# Altium project QUTMS_HVBoard_V1_1.PrjPcb
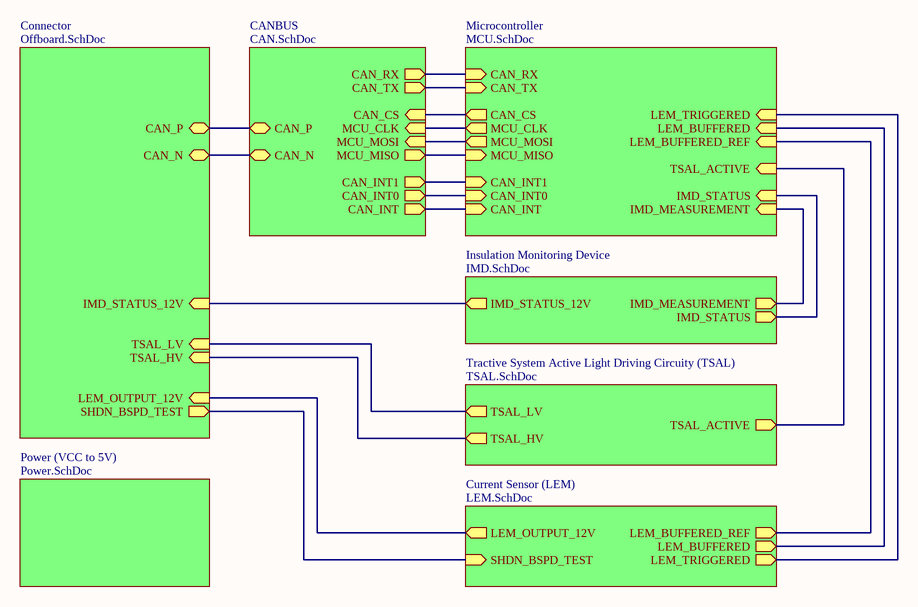
[diagram p0: Master.SchDoc]
8 sheets, 128 parts. Net scope: hierarchical (ports join the sheet entries above them; power ports are global).
Board file: HVBoard.PcbDoc
Sheets:
  Master.SchDoc
    Connector = Offboard.SchDoc
    Microcontroller = MCU.SchDoc
    Insulation Monitoring Device = IMD.SchDoc
    Current Sensor (LEM) = LEM.SchDoc
    CANBUS = CAN.SchDoc
    Tractive System Active Light Driving Circuity (TSAL) = TSAL.SchDoc
    Power (VCC to 5V) = Power.SchDoc

## Sheet Master.SchDoc: QUTMS HVBoard V1.1 - Master
size A4; DocumentNumber: 1; SheetNumber: 1; SheetTotal: 8

### Sub-sheets
CANBUS = CAN.SchDoc: MCU_MOSI (in), MCU_CLK (in), CAN_CS (in), MCU_MISO (out), CAN_N (bidir), CAN_P (bidir), CAN_INT1 (out), CAN_INT0 (out), CAN_INT (out), CAN_RX (out), CAN_TX (out)
Connector = Offboard.SchDoc: SHDN_BSPD_TEST (out), TSAL_LV (in), CAN_P (bidir), TSAL_HV (in), CAN_N (bidir), LEM_OUTPUT_12V (in), IMD_STATUS_12V (in)
Current Sensor (LEM) = LEM.SchDoc: SHDN_BSPD_TEST (in), LEM_BUFFERED_REF (out), LEM_BUFFERED (out), LEM_OUTPUT_12V (out), LEM_TRIGGERED (out)
Insulation Monitoring Device = IMD.SchDoc: IMD_STATUS_12V (out), IMD_MEASUREMENT (out), IMD_STATUS (out)
Microcontroller = MCU.SchDoc: CAN_INT (in), CAN_INT0 (in), CAN_INT1 (in), MCU_MISO (in), MCU_MOSI (out), MCU_CLK (out), CAN_CS (out), LEM_BUFFERED_REF (in), LEM_BUFFERED (in), IMD_MEASUREMENT (in), IMD_STATUS (in), TSAL_ACTIVE (in), LEM_TRIGGERED (in), CAN_RX (in), CAN_TX (in)
Power (VCC to 5V) = Power.SchDoc: no entries
Tractive System Active Light Driving Circuity (TSAL) = TSAL.SchDoc: TSAL_HV (out), TSAL_LV (out), TSAL_ACTIVE (out)

### Nets
CAN_CS: sheet Microcontroller/CAN_CS, sheet CANBUS/CAN_CS
CAN_INT: sheet Microcontroller/CAN_INT, sheet CANBUS/CAN_INT
CAN_INT0: sheet Microcontroller/CAN_INT0, sheet CANBUS/CAN_INT0
CAN_INT1: sheet Microcontroller/CAN_INT1, sheet CANBUS/CAN_INT1
CAN_N: sheet Connector/CAN_N, sheet CANBUS/CAN_N
CAN_P: sheet Connector/CAN_P, sheet CANBUS/CAN_P
CAN_RX: sheet Microcontroller/CAN_RX, sheet CANBUS/CAN_RX
CAN_TX: sheet Microcontroller/CAN_TX, sheet CANBUS/CAN_TX
IMD_MEASUREMENT: sheet Microcontroller/IMD_MEASUREMENT, sheet Insulation Monitoring Device/IMD_MEASUREMENT
IMD_STATUS: sheet Microcontroller/IMD_STATUS, sheet Insulation Monitoring Device/IMD_STATUS
LEM_BUFFERED: sheet Microcontroller/LEM_BUFFERED, sheet Current Sensor (LEM)/LEM_BUFFERED
LEM_BUFFERED_REF: sheet Microcontroller/LEM_BUFFERED_REF, sheet Current Sensor (LEM)/LEM_BUFFERED_REF
MCU_CLK: sheet Microcontroller/MCU_CLK, sheet CANBUS/MCU_CLK
MCU_MISO: sheet Microcontroller/MCU_MISO, sheet CANBUS/MCU_MISO
MCU_MOSI: sheet Microcontroller/MCU_MOSI, sheet CANBUS/MCU_MOSI
TSAL_ACTIVE: sheet Microcontroller/TSAL_ACTIVE, sheet Tractive System Active Light Driving Circuity (TSAL)/TSAL_ACTIVE
NetJ4_2: sheet Connector/SHDN_BSPD_TEST, sheet Current Sensor (LEM)/SHDN_BSPD_TEST
NetJ4_4: sheet Connector/IMD_STATUS_12V, sheet Insulation Monitoring Device/IMD_STATUS_12V
NetJ4_5: sheet Connector/TSAL_HV, sheet Tractive System Active Light Driving Circuity (TSAL)/TSAL_HV
NetJ4_8: sheet Connector/TSAL_LV, sheet Tractive System Active Light Driving Circuity (TSAL)/TSAL_LV
NetJ4_9: sheet Connector/LEM_OUTPUT_12V, sheet Current Sensor (LEM)/LEM_OUTPUT_12V
NetR10_2: sheet Microcontroller/LEM_TRIGGERED, sheet Current Sensor (LEM)/LEM_TRIGGERED

### Notes on the sheet
- Title
- Size:
- A4
- Number:
- Revision:
- QUT Motorsport, O-120
- O Block, QUT Gardens Point
- Date:
- Time:
- Sheet
- of
- Brisbane, QLD, Australia

## Sheet Offboard.SchDoc: QUTMS HVBoard V1.1 - Offboard
size A4; Author: Jonn Dillon; Organization: QUT Motorsport; Address1: O-120; Address2: O Block; Address3: QUT Gardens Point; Address4: Brisbane, 4000; DocumentNumber: 8; SheetNumber: 8; SheetTotal: 8
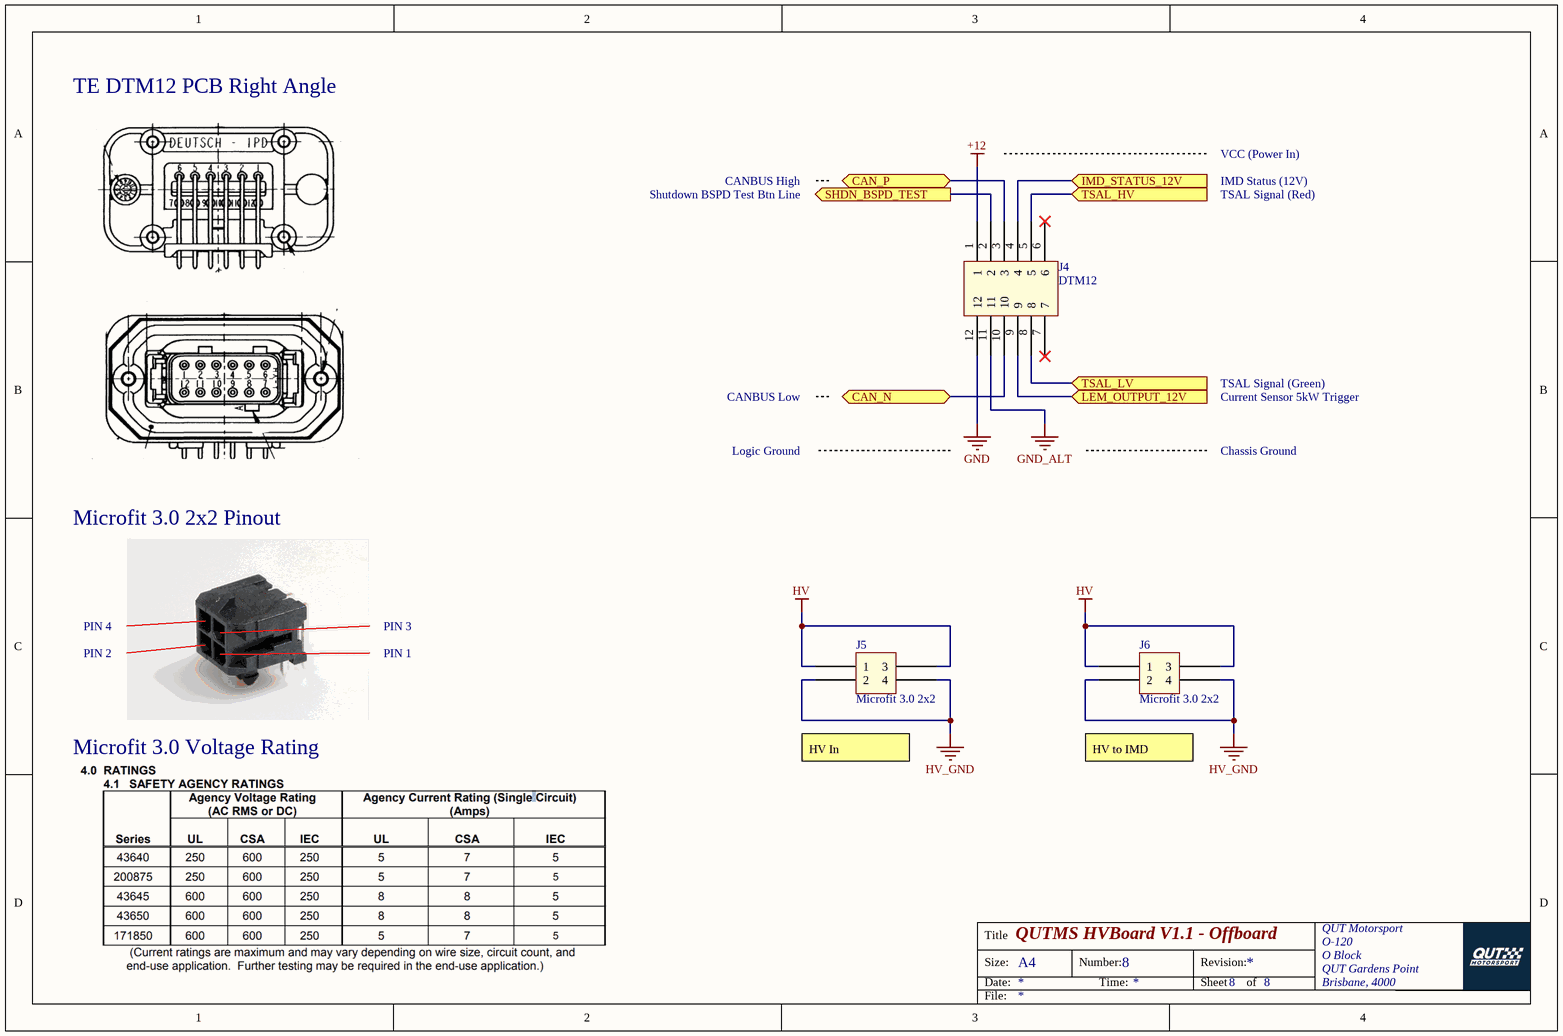
[diagram p1: Offboard.SchDoc]

### Parts
J4  DTM12  [DTM13-12PA]
J5  Microfit 3.0 2x2  [Microfit_2X2_R_TH]
J6  Microfit 3.0 2x2  [Microfit_2X2_R_TH]

### Ports
CAN_N (bidir), CAN_P (bidir), IMD_STATUS_12V (in), LEM_OUTPUT_12V (in), SHDN_BSPD_TEST (out), TSAL_HV (in), TSAL_LV (in)

### Nets
+12: J4.1
GND: J4.12
GND_ALT: J4.11
HV: J5.1 J5.3 J6.1 J6.3
HV_GND: J5.2 J5.4 J6.2 J6.4
CAN_N: J4.10 ; port CAN_N
CAN_P: J4.3 ; port CAN_P
NetJ4_2: J4.2 ; port SHDN_BSPD_TEST
NetJ4_4: J4.4 ; port IMD_STATUS_12V
NetJ4_5: J4.5 ; port TSAL_HV
NetJ4_8: J4.8 ; port TSAL_LV
NetJ4_9: J4.9 ; port LEM_OUTPUT_12V

Not connected (* = marked no-connect by the designer): J4 6* 7*

### Notes on the sheet
- TE DTM12 PCB Right Angle
- CANBUS High
- IMD Status (12V)
- VCC (Power In)
- Shutdown BSPD Test Btn Line
- TSAL Signal (Red)
- TSAL Signal (Green)
- CANBUS Low
- Logic Ground
- Chassis Ground
- Current Sensor 5kW Trigger
- Microfit 3.0 2x2 Pinout
- PIN 2
- PIN 4
- PIN 1
- PIN 3
- Microfit 3.0 Voltage Rating
- HV In
- HV to IMD
- Title
- Size:
- Date:
- A4
- Number:
- Time:
- Revision:
- Sheet
- of
- File:

### Library data of the parts
J5 J6 = Microfit_2x2

## Sheet MCU.SchDoc: QUTMS HVBoard V1.1 - MCU
size A4; Author: Jonn Dillon; Organization: QUT Motorsport; Address1: O-120; Address2: O Block; Address3: QUT Gardens Point; Address4: Brisbane, 4000; DocumentNumber: 5; SheetNumber: 5; SheetTotal: 8
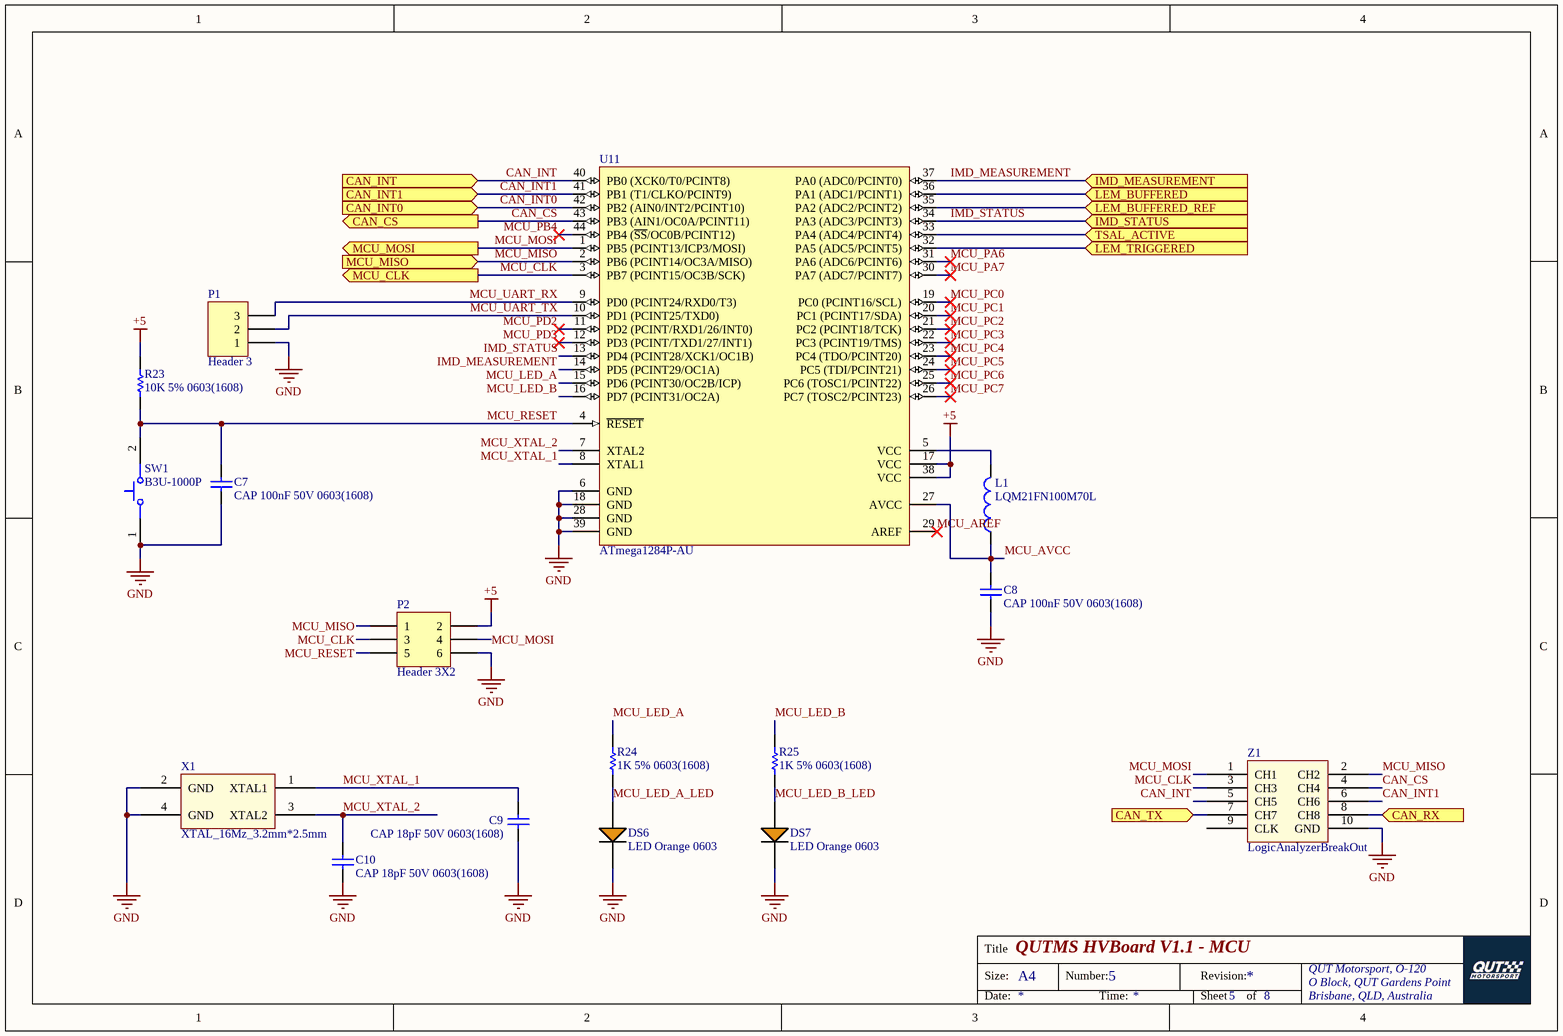
[diagram p2: MCU.SchDoc]

### Parts
C7  CAP 100nF 50V 0603(1608)  [CAPC0603(1608)100_L]
C8  CAP 100nF 50V 0603(1608)  [CAPC0603(1608)100_L]
C9  CAP 18pF 50V 0603(1608)  [CAPC0603(1608)100_L]
C10  CAP 18pF 50V 0603(1608)  [CAPC0603(1608)100_L]
DS6  LED Orange 0603  [LED ORANGE 0603]
DS7  LED Orange 0603  [LED ORANGE 0603]
L1  LQM21FN100M70L  [MURA-IND0805_L]
P1  Header 3  [HDR1X3]
P2  Header 3X2  [HDR2X3]
R23  10K 5% 0603(1608)  [RESC0603(1608)_N]
R24  1K 5% 0603(1608)  [RESC0603(1608)_L]
R25  1K 5% 0603(1608)  [RESC0603(1608)_L]
SW1  B3U-1000P  [OMRON-B3U-1000_V]
U11  ATmega1284P-AU  [44A_N]
X1  XTAL_16Mz_3.2mm*2.5mm  [3.2mm*2.5mm]
Z1  LogicAnalyzerBreakOut  [LogicAnalyzer]

### Ports
CAN_CS (out), CAN_INT0 (in), CAN_INT1 (in), CAN_INT (in), CAN_RX (in), CAN_TX (in), IMD_MEASUREMENT (in), IMD_STATUS (in), LEM_BUFFERED (in), LEM_BUFFERED_REF (in), LEM_TRIGGERED (in), MCU_CLK (out), MCU_MISO (in), MCU_MOSI (out), TSAL_ACTIVE (in)

### Nets
+5: P2.2 R23.2 U11.17(VCC) U11.38(VCC)
GND: C7.2 C8.2 C9.1 C10.1 DS6.2(C) DS7.2(C) P1.1 P2.6 SW1.1 U11.6(GND) U11.18(GND) U11.28(GND) U11.39(GND) X1.2(GND) X1.4(GND) Z1.10(GND)
CAN_CS: U11.43(PB3_(AIN1/OC0A/PCINT11)) Z1.4(CH4) ; port CAN_CS
CAN_INT: U11.40(PB0_(XCK0/T0/PCINT8)) Z1.5(CH5) ; port CAN_INT
CAN_INT0: U11.42(PB2_(AIN0/INT2/PCINT10)) ; port CAN_INT0
CAN_INT1: U11.41(PB1_(T1/CLKO/PCINT9)) Z1.6(CH6) ; port CAN_INT1
CAN_RX: Z1.8(CH8) ; port CAN_RX
CAN_TX: Z1.7(CH7) ; port CAN_TX
IMD_MEASUREMENT: U11.14(PD5_(PCINT29/OC1A)) U11.37(PA0_(ADC0/PCINT0)) ; port IMD_MEASUREMENT
IMD_STATUS: U11.13(PD4_(PCINT28/XCK1/OC1B)) U11.34(PA3_(ADC3/PCINT3)) ; port IMD_STATUS
LEM_BUFFERED: U11.36(PA1_(ADC1/PCINT1)) ; port LEM_BUFFERED
LEM_BUFFERED_REF: U11.35(PA2_(ADC2/PCINT2)) ; port LEM_BUFFERED_REF
MCU_AREF: U11.29(AREF)
MCU_AVCC: C8.1 L1.1 U11.27(AVCC)
MCU_CLK: P2.3 U11.3(PB7_(PCINT15/OC3B/SCK)) Z1.3(CH3) ; port MCU_CLK
MCU_LED_A: R24.2 U11.15(PD6_(PCINT30/OC2B/ICP))
MCU_LED_A_LED: DS6.1(A) R24.1
MCU_LED_B: R25.2 U11.16(PD7_(PCINT31/OC2A))
MCU_LED_B_LED: DS7.1(A) R25.1
MCU_MISO: P2.1 U11.2(PB6_(PCINT14/OC3A/MISO)) Z1.2(CH2) ; port MCU_MISO
MCU_MOSI: P2.4 U11.1(PB5_(PCINT13/ICP3/MOSI)) Z1.1(CH1) ; port MCU_MOSI
MCU_PA6: U11.31(PA6_(ADC6/PCINT6))
MCU_PA7: U11.30(PA7_(ADC7/PCINT7))
MCU_PB4: U11.44(PB4_(~{SS}/OC0B/PCINT12))
MCU_PC0: U11.19(PC0_(PCINT16/SCL))
MCU_PC1: U11.20(PC1_(PCINT17/SDA))
MCU_PC2: U11.21(PC2_(PCINT18/TCK))
MCU_PC3: U11.22(PC3_(PCINT19/TMS))
MCU_PC4: U11.23(PC4_(TDO/PCINT20))
MCU_PC5: U11.24(PC5_(TDI/PCINT21))
MCU_PC6: U11.25(PC6_(TOSC1/PCINT22))
MCU_PC7: U11.26(PC7_(TOSC2/PCINT23))
MCU_PD2: U11.11(PD2_(PCINT/RXD1/26/INT0))
MCU_PD3: U11.12(PD3_(PCINT/TXD1/27/INT1))
MCU_RESET: C7.1 P2.5 R23.1 SW1.2 U11.4(~{RESET})
MCU_UART_RX: P1.3 U11.9(PD0_(PCINT24/RXD0/T3))
MCU_UART_TX: P1.2 U11.10(PD1_(PCINT25/TXD0))
MCU_XTAL_1: C9.2 U11.8(XTAL1) X1.1(XTAL1)
MCU_XTAL_2: C10.2 U11.7(XTAL2) X1.3(XTAL2)
TSAL_ACTIVE: U11.33(PA4_(ADC4/PCINT4)) ; port TSAL_ACTIVE
NetL1_2: L1.2 U11.5(VCC)
NetR10_2: U11.32(PA5_(ADC5/PCINT5)) ; port LEM_TRIGGERED

Not connected (* = marked no-connect by the designer): Z1 9(CLK)

### Notes on the sheet
- Title
- Size:
- A4
- Number:
- Revision:
- QUT Motorsport, O-120
- O Block, QUT Gardens Point
- Date:
- Time:
- Sheet
- of
- Brisbane, QLD, Australia

### Library data of the parts
C7 C8 = CMP-1035-02591-1: CAP 100nF 50V ±5% 0603 (1608 Metric) Thickness 1mm SMD; Tolerance: Â±5%; Case-Metric: 1608; Case-EIA: 0603; Rated Voltage: 50 V; Max Thickness: 1 mm; Technology: SMT; Value: 100nF
C9 C10 = CMP-1035-00748-1: CAP 18pF 50V ±1% 0603 (1608 Metric) Thickness 1mm SMD; Case-EIA: 0603; Case-Metric: 1608; Tolerance: Â±1%; Max Thickness: 1 mm; Value: 18pF; Rated Voltage: 50 V; Technology: SMT
L1 = CMP-2000-06587-1: Fixed Inductor, 10 uH, +/-20%, -55 to 125 degC, 2-Pin SMD (0805), RoHS, Tape and Reel; Manufacturer: Murata; Tolerance (%): 20%; DC Resistance: 0.6; Inductance-Nom: 10H; Rated Current-Max: 100mA; Package Reference: IND0805; Case Size/Dimension: 0805; Manufacturer URL: http://www.murata.com/; Package Description: 2-Pin Surface Mount Device, Body 2 x 1.25 mm; Datasheet URL: http://psearch.en.murata.com/inductor/product/LQM21FN100M70%23.pdf; Mounting Technology: SurfaceMount; Datasheet Version: 05/2016
P1 = Header 3: Header, 3-Pin; LatestRevisionDate: 17-Jul-2002; LatestRevisionNote: Re-released for DXP Platform.; Publisher: Altium Limited
P2 = Header 3X2: Header, 3-Pin, Dual row; LatestRevisionDate: 17-Jul-2002; LatestRevisionNote: Re-released for DXP Platform.; Publisher: Altium Limited
R23 = CMP-1012-00098-1: 10K 0.1W 5% 0603 (1608 Metric)  SMD; Case-EIA: 0603; Value: 10000.00 Ohm; Case-Metric: 1608; Technology: SMT; Tolerance: 5 %; Power: 0.1 W
R24 R25 = CMP-1012-00074-1: 1K 0.1W 5% 0603 (1608 Metric)  SMD; Case-EIA: 0603; Case-Metric: 1608; Value: 1000.00 Ohm; Technology: SMT; Tolerance: 5 %; Power: 0.1 W
SW1 = CMP-2100-03586-1: Ultra-Small Tactile Switch, 0.05 A, 12 V, -25 to 70 degC, 2-Pin SMD, RoHS, Tape and Reel; Manufacturer: Omron Electronic Components; Operating Force: 1.5N; Current Rating: 50mA; Voltage Rating (DC): 12V; Electrical Life: 200000Cycles; Actuator Length: 0.4mm; Insulation Resistance: 100MOhm; Switch Travel: 0.15mm; Throw Configuration: SPST; Illumination Type: Illuminated; Width: 3mm; Weight: 0.022g; Datasheet Version: 42005.0; Datasheet URL: http://www.omron.com/ecb/products/pdf/en-b3u.pdf; Height: 1.2mm; Package Quantity: 1; REACH SVHC: Unknown; Contact Current Rating: 50mA; Contact Material: Silver; Max Current Rating: 50mA; Package Reference: B3U-1000; Termination: SMD/SMT; Packaging: TapeandReel; Manufacturer URL: http://www.omron.com/; RoHSCompliant: true; Mount: SurfaceMount; Length: 4mm; Min Operating Temperature: -25degC; Depth: 2.5mm; Lead Free: LeadFree; Case/Package: SMD/SMT; Package Description: 2-Pin Surface Mount Device, Body 3 x 2.5 mm; Max Operating Temperature: 70degC; Orientation: Straight
U11 = CMP-0095-00577-1: 8-bit AVR Microcontroller, 128KB Flash, 4KB EEPROM, 16KB SRAM, 44-pin TQFP, Industrial Grade (-40°C to 85°C); PackageReference: 44A; Code_JEDEC: MS-026-ACB; ComponentLink3Description: ATmega164A/164PA/324A/324PA/644A/644PA/1284/1284P Summary; DatasheetVersion: revC, Jun-2011; PackageDescription: 44-Pin Plastic Thin Profile Quad Flat Pack, 10 x 10 x 1.0 mm Body, 0.8 mm Pitch (TQFP); ComponentLink3URL: http://www.atmel.com/dyn/resources/prod_documents/8272S.pdf; ComponentLink1URL: http://www.atmel.com/; ComponentLink1Description: Manufacturer URL; ComponentLink2Description: ATmega164A/164PA/324A/324PA/644A/644PA/1284/1284P Datasheet; ComponentLink2URL: http://www.atmel.com/dyn/resources/prod_documents/doc8272.pdf; PackageVersion: revC, Oct-2010
Z1 = LogicAnalyer
X1 = XTAL_16Mz_3.2mm*2.5mm: ComponentLink1Description: LCSC; ComponentLink1URL: https://lcsc.com/product-detail/SMD-Crystal-Resonators_Yangxing-Tech-X322516MOB4SI_C12668.html

## Sheet IMD.SchDoc: QUTMS - HVBoard V1.1 - IMD
size A3; Author: Jonn Dillon; Organization: QUT Motorsport; Address1: O-120; Address2: O Block; Address3: QUT Gardens Point; Address4: Brisbane, 4000; DocumentNumber: 2; Revision: 2; SheetNumber: 2; SheetTotal: 8
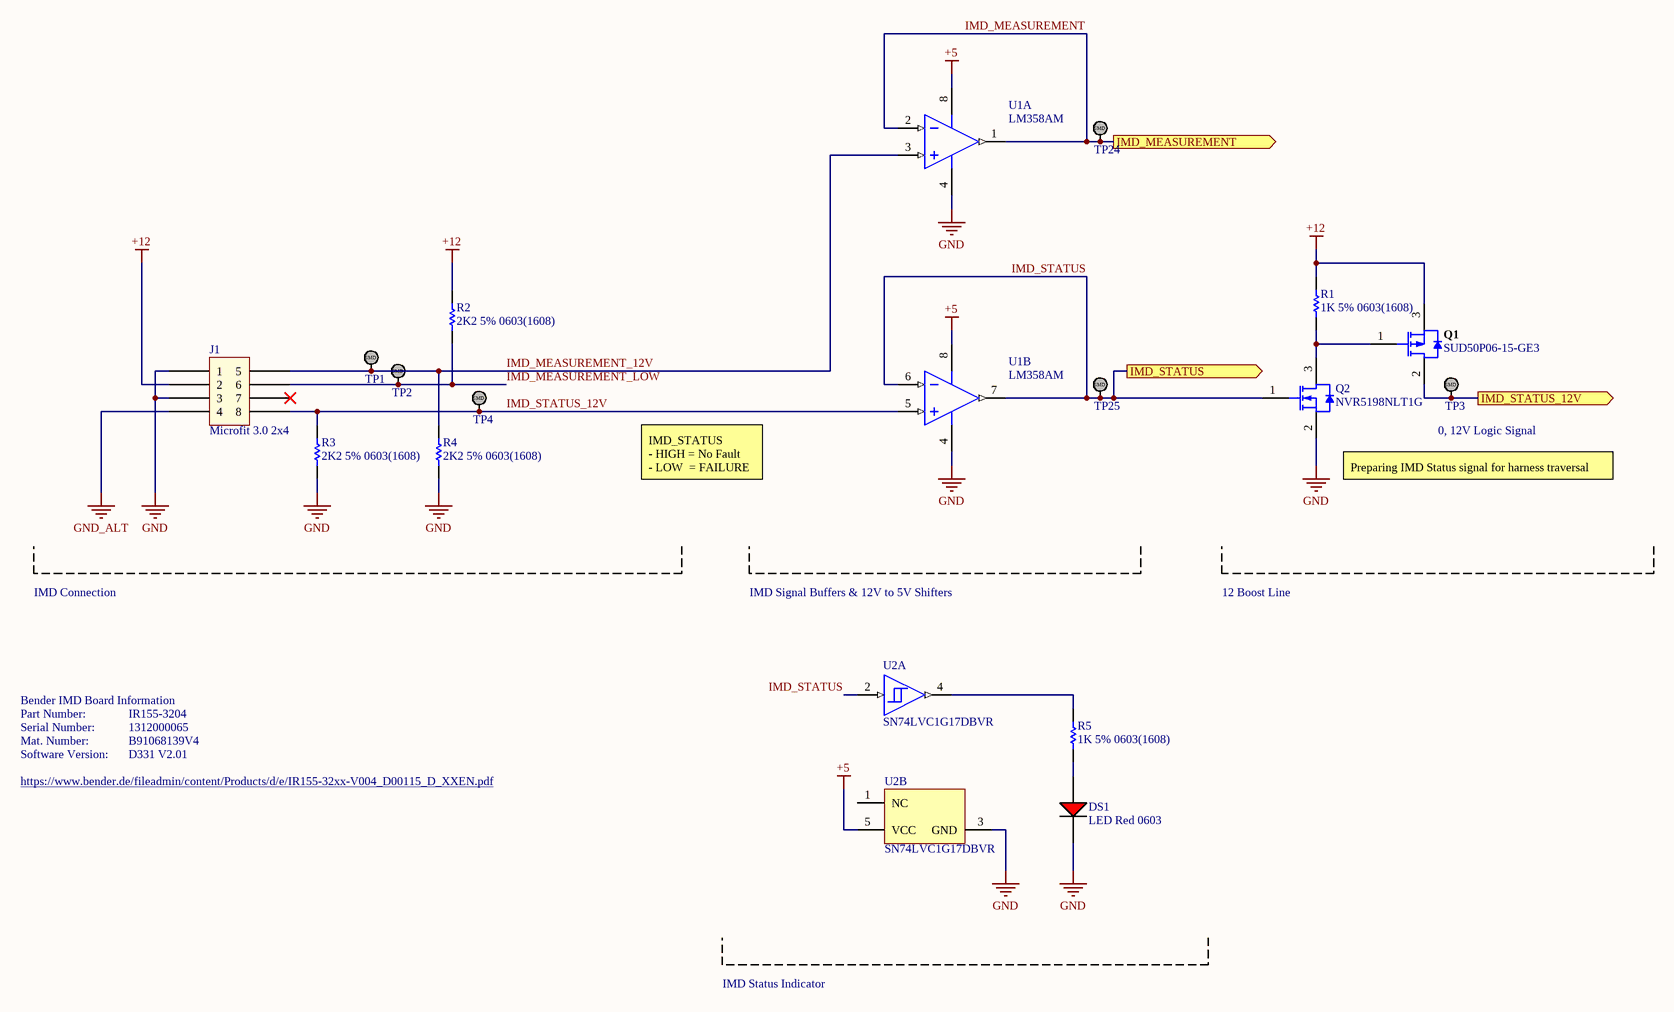
[diagram p3: IMD.SchDoc]

### Parts
DS1  LED Red 0603  [LED RED 0603]
J1  Microfit 3.0 2x4  [Microfit_2X4_R_TH]
Q1  SUD50P06-15-GE3  [VSIL-TO-252AA-3_V]
Q2  NVR5198NLT1G  [ONSC-SOT-23-3-318-08_V]
R1  1K 5% 0603(1608)  [RESC0603(1608)_L]
R2  2K2 5% 0603(1608)  [RESC0603(1608)_N]
R3  2K2 5% 0603(1608)  [RESC0603(1608)_N]
R4  2K2 5% 0603(1608)  [RESC0603(1608)_N]
R5  1K 5% 0603(1608)  [RESC0603(1608)_L]
TP1  TestPoint_SMD  [TestPointSMD]  (value not drawn)
TP2  TestPoint_SMD  [TestPointSMD]  (value not drawn)
TP3  TestPoint_SMD  [TestPointSMD]  (value not drawn)
TP4  TestPoint_SMD  [TestPointSMD]  (value not drawn)
TP24  TestPoint_SMD  [TestPointSMD]  (value not drawn)
TP25  TestPoint_SMD  [TestPointSMD]  (value not drawn)
U1  LM358AM  [D0008A_N]  (parts A,B of 2)
U2  SN74LVC1G17DBVR  [DBV0005A_L]  (parts A,B of 2)

### Ports
IMD_MEASUREMENT (out), IMD_STATUS (out), IMD_STATUS_12V (out)

### Nets
+5: U1.8(V+) U2.5(VCC)
+12: J1.2 Q1.3(S) R1.2 R2.2
GND: DS1.2(C) J1.1 J1.3 Q2.2(S) R3.1 R4.1 U1.4(GND) U2.3(GND)
GND_ALT: J1.4
IMD_MEASUREMENT: TP24.1 U1.1(OUTA) U1.2(INA-) ; port IMD_MEASUREMENT
IMD_MEASUREMENT_12V: J1.5 R4.2 TP1.1 U1.3(INA+)
IMD_MEASUREMENT_LOW: J1.6 R2.1 TP2.1
IMD_STATUS: Q2.1(G) TP25.1 U1.6(INB-) U1.7(OUTB) U2.2(A) ; port IMD_STATUS
IMD_STATUS_12V: J1.8 R3.2 TP4.1 U1.5(INB+)
NetDS1_1: DS1.1(A) R5.1
NetJ4_4: Q1.2(D) TP3.1 ; port IMD_STATUS_12V
NetQ1_1: Q1.1(G) Q2.3(D) R1.1
NetR5_2: R5.2 U2.4(Y)

Not connected (* = marked no-connect by the designer): J1 7*; U2 1(NC)

### Notes on the sheet
- (near TP3) 0, 12V Logic Signal
- IMD_STATUS
  - HIGH = No Fault
  - LOW  = FAILURE
- Preparing IMD Status signal for harness traversal
- IMD Connection
- IMD Signal Buffers & 12V to 5V Shifters
- 12 Boost Line
- Bender IMD Board Information
- Part Number:
- Serial Number:
- IR155-3204
- 1312000065
- https://www.bender.de/fileadmin/content/Products/d/e/IR155-32xx-V004_D00115_D_XXEN.pdf
- Mat. Number:
- Software Version:
- B91068139V4
- D331 V2.01
- IMD Status Indicator
- Title
- Size:
- A4
- Number:
- Revision:
- QUT Motorsport, O-120
- O Block, QUT Gardens Point
- Date:
- Time:
- Sheet
- of
- Brisbane, QLD, Australia
- (in symbol TestPoint_SMD) SMD

### Library data of the parts
J1 = Microfit_2x4
Q1 = CMP-2000-05431-1: P-Channel (D-S) MOSFET, 30 V, -55 to 150 degC, 3-Pin TO-252, RoHS, Tape and Reel; Manufacturer: Vishay; Unit Weight: 0.050717oz; Id - Continuous Drain Current: 50A; Rise Time: 70ns; Fall Time: 175ns; Configuration: Single; Rds On - Drain-Source Resistance: 15mOhms; Transistor Type: 1P-Channel; Channel Mode: Enhancement; Number of Channels: 1Channel; Typical Turn-On Delay Time: 15ns; Brand: VishaySemiconductors; Pd - Power Dissipation: 2.5W; Vds - Drain-Source Breakdown Voltage: -60V; Vgs - Gate-Source Voltage: 20V; Mounting Style: SMD/SMT; Package / Case: TO-252AA-3; Height: 2.39mm; Datasheet Version: Rev. C, 07/2013; Factory Pack Quantity: 2000; RoHS: True; Typical Turn-Off Delay Time: 175ns; Minimum Operating Temperature: -55C; Tradename: TrenchFET; Manufacturer URL: http://www.vishay.com/; Package Description: 3-Pin Surface Mount Device, Body 6.54 x 6.095 mm, Pitch 2.28 mm; Package Reference: TO-252; Transistor Polarity: P-Channel; Technology: Si; Series: SUD; Datasheet URL: https://datasheet.ciiva.com/4444/sud50p06-244530-4444327.pdf; Width: 6.22mm; Product Category: MOSFET; Packaging: Reel; Length: 6.73mm; Package URL: http://www.vishay.com/docs/89975/v15wl45c-m3.pdf; Maximum Operating Temperature: +150C
Q2 = CMP-1058-00774-1: Power MOSFET, 60 V, 155 mOhm, Single N-Channel Logic Level, 3-Pin SOT-23, Pb-Free, Tape and Reel; Manufacturer: On Semiconductor; Ciss Typ (pF): 182; Coss Typ (pF): 25; ID Max (A): 2.2; Crss Typ (pF): 16; V(BR)DSS Min (V): 60; Qrr Typ (nC): 6; VGS Max (V): 20; VGS(th) Max (V): 2.5; Channel Polarity: N Channel; Package Type: SOT-23-3; ComponentLink1URL: http://www.onsemi.com/; ComponentLink2Description: Datasheet; ComponentLink1Description: Manufacturer URL; Mounting Technology: Surface Mount; Configuration: Single; Packing: Tape and Reel; RoHS: Pb-Free; ComponentLink3URL: http://www.onsemi.cn/pub_link/Collateral/318-08.PDF; PackageVersion: Rev. AP, 11/2009; PackageReference: SOT-23-3-318-08; DatasheetVersion: Rev. 1; PackageDescription: 3-Pin Small Outline Transistor, Body 2.92 x 1.3 mm, Pitch 0.95 mm; ComponentLink3Description: Package Specification; ComponentLink2URL: http://www.onsemi.com/pub_link/Collateral/NVR5198NL-D.PDF; PartNumber: NVR5198NLT1G
R1 R5 = CMP-1012-00074-1: as R24 on sheet MCU; Technology: SMT; Tolerance: 5 %; Power: 0.1 W
R2-R4 = CMP-1012-00082-1: 2K2 0.1W 5% 0603 (1608 Metric)  SMD; Case-Metric: 1608; Value: 2200.00 Ohm; Case-EIA: 0603; Power: 0.1 W; Tolerance: 5 %; Technology: SMT
U1 = CMP-0055-00796-3: Low Power Dual Operational Amplifier, 8-pin Narrow SOIC; Manufacturer: Texas Instruments; CompType: Amplifiers; PackageTopMarking: NSZXTT*LM*358AM; PowerWise: N; Code_JEDEC: MS-012-AA; RoHS: N; PinCount: 8; Package Reference: D0008A; ComponentLink1Description: Datasheet URL; ComponentLink1URL: http://www.ti.com/general/docs/lit/getliterature.tsp?genericPartNumber=LM358-N&fileType=pdf; Code_IPC: SOIC127P600-8; PackageDescription: SOIC Narrow, 4.9 x 3.9 x 1.45mm, 8 Lead, 1.27mm Pitch
U2 = CMP-0859-00033-4: Single Schmitt-Trigger Buffer, DBV0005A, LARGE T&R; Manufacturer: Texas Instruments; Output Drive (IOL/IOH)(Max)(mA): 32/-32; Technology Family: LVC; ICC @ Nom Voltage(Max)(mA): 0.01; VCC(Min)(V): 1.65; F @ Nom Voltage(Max)(Mhz): 150; Schmitt Trigger: Yes; Voltage(Nom)(V): 1.8,2.5,3.3,5; 3-State Output: No; Bits(#): 1; VCC(Max)(V): 5.5; Input Type: CMOS/TTL; Logic: True; tpd @ Nom Voltage(Max)(ns): 11,6.5,5.5,5; Output Type: CMOS; Rating: Catalog; Sub-Family: Non-Inverting Buffer/Driver; PackageReference: DBV0005A; DatasheetVersion: SCES351V; Generic Part Number: SN74LVC1G17; Operating Temperature Range(C): -40 to 125,-40 to 85

## Sheet LEM.SchDoc: QUTMS - HVBoard V1.1 - LEM
size A3; Author: Jonn Dillon; Organization: QUT Motorsport; Address1: O-120; Address2: O Block; Address3: QUT Gardens Point; Address4: Brisbane, 4000; DocumentNumber: 3; Revision: 3; SheetNumber: 3; SheetTotal: 8
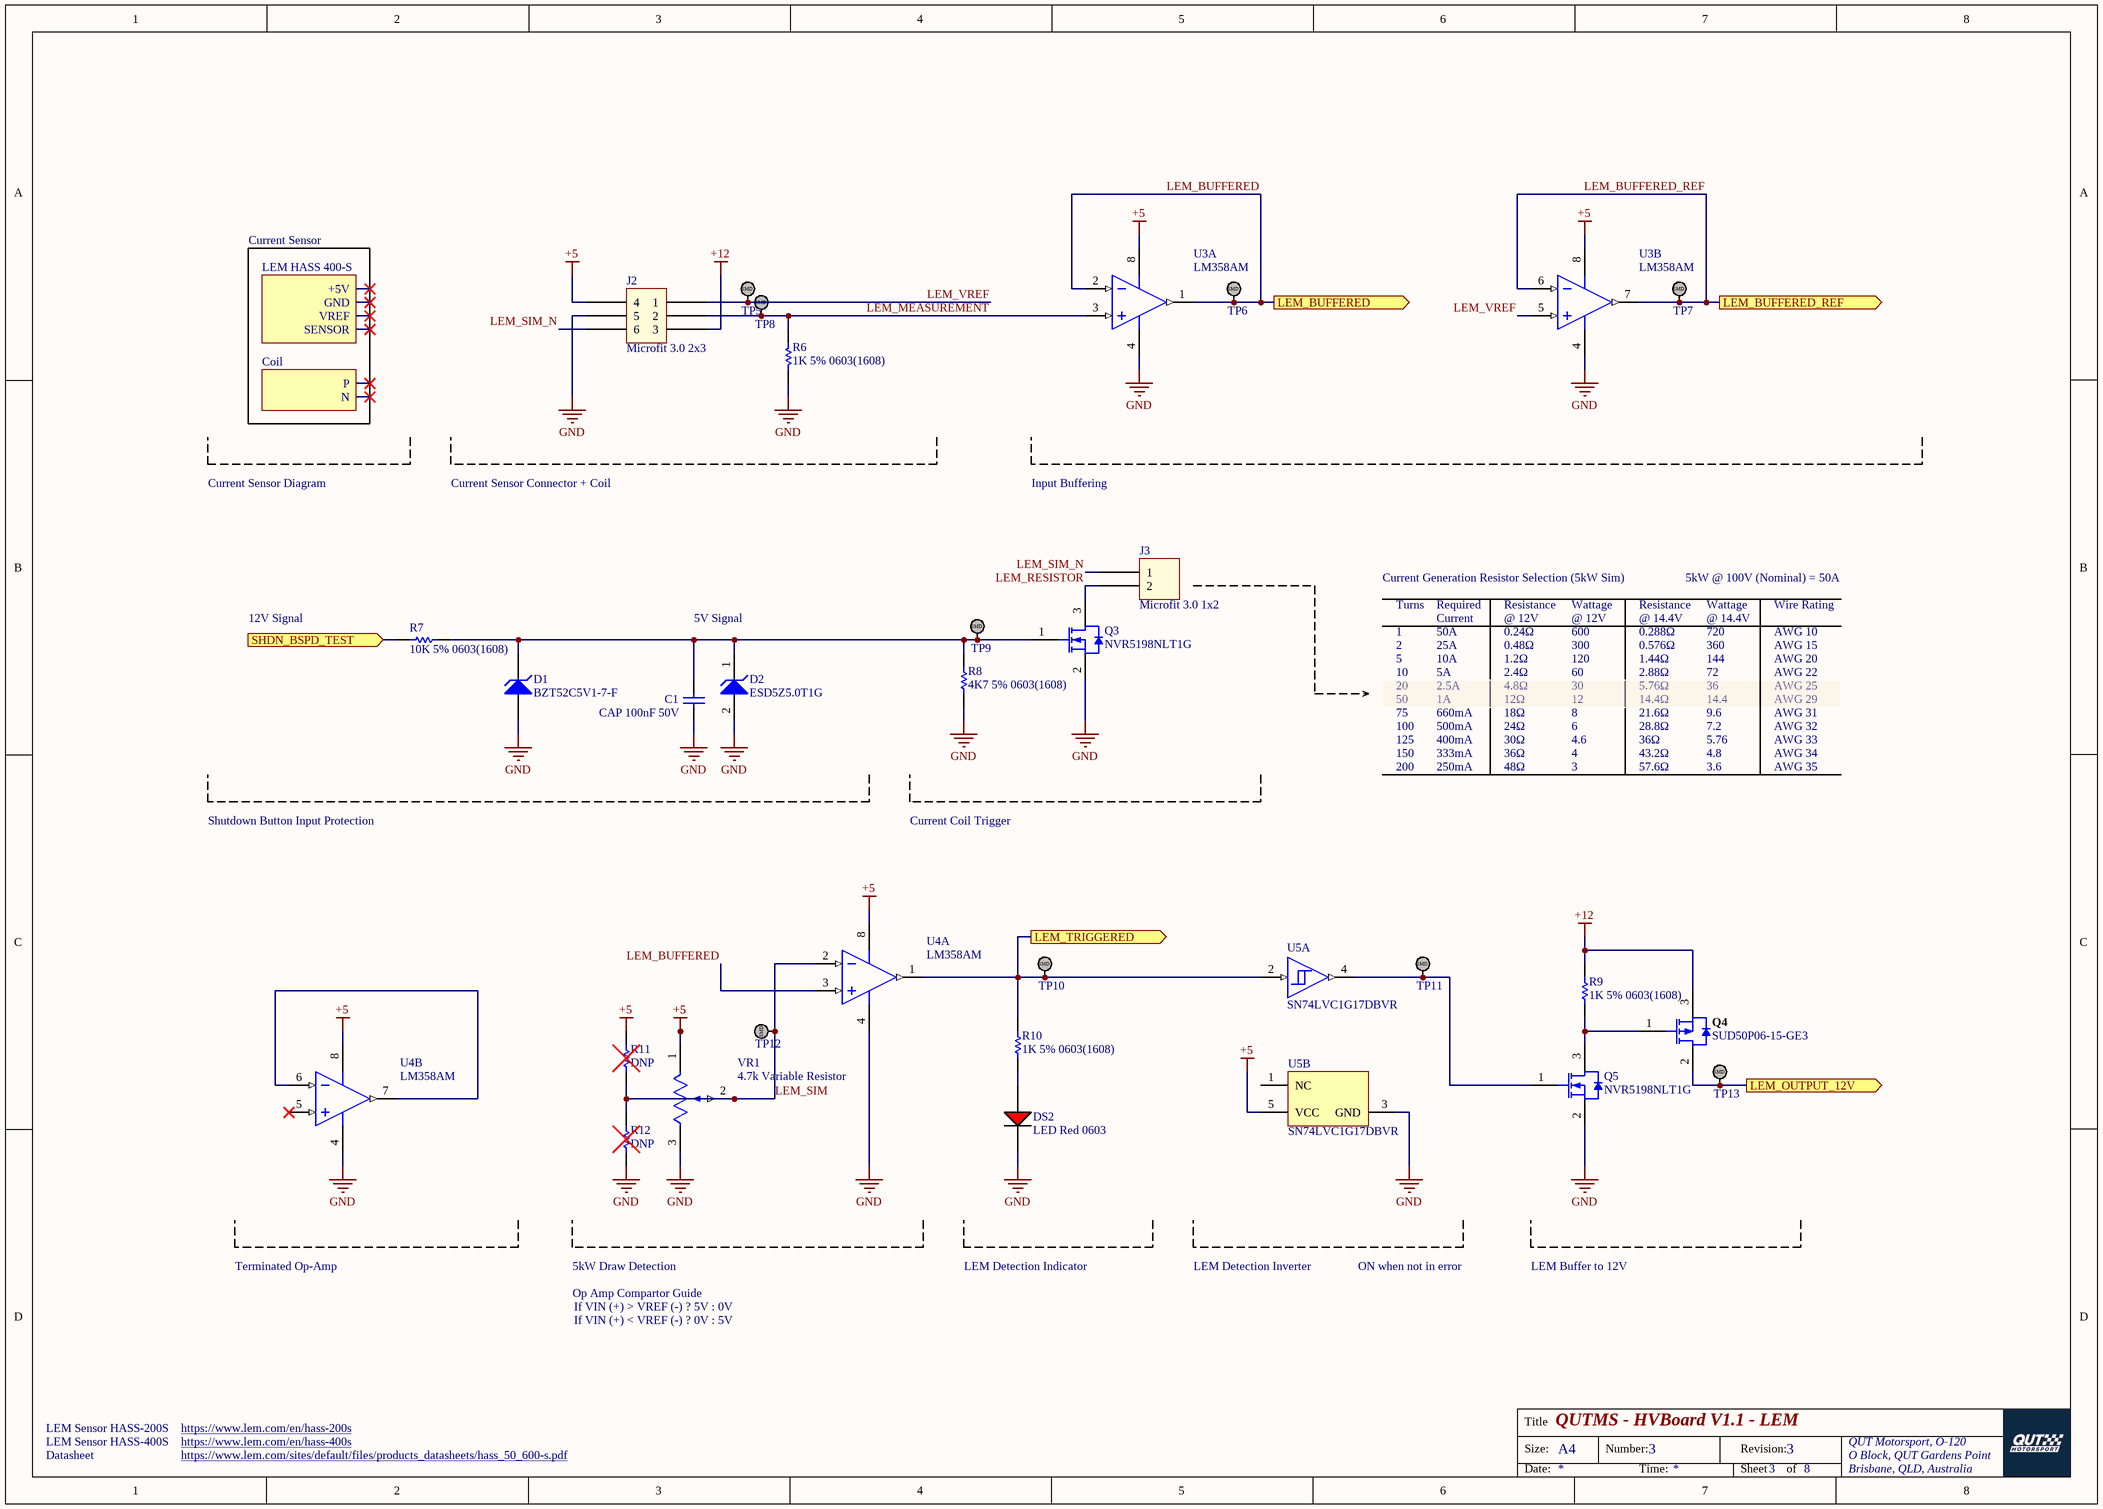
[diagram p4: LEM.SchDoc]

### Parts
C1  CAP 100nF 50V  [CAPC0603(1608)100_L]
D1  BZT52C5V1-7-F  [DIOD-SOD123_V]
D2  ESD5Z5.0T1G  [ONSC-SOD-523-2-502-01_V]
DS2  LED Red 0603  [LED RED 0603]
J2  Microfit 3.0 2x3  [Microfit_2X3_R_TH]
J3  Microfit 3.0 1x2  [Microfit_1X2_R_TH]
Q3  NVR5198NLT1G  [ONSC-SOT-23-3-318-08_V]
Q4  SUD50P06-15-GE3  [VSIL-TO-252AA-3_V]
Q5  NVR5198NLT1G  [ONSC-SOT-23-3-318-08_V]
R6  1K 5% 0603(1608)  [RESC0603(1608)_L]
R7  10K 5% 0603(1608)  [RESC0603(1608)_N]
R8  4K7 5% 0603(1608)  [RESC0603(1608)_N]
R9  1K 5% 0603(1608)  [RESC0603(1608)_L]
R10  1K 5% 0603(1608)  [RESC0603(1608)_L]
R11  DNP  [RESC0603(1608)_L]
R12  DNP  [RESC0603(1608)_L]
TP5  TestPoint_SMD  [TestPointSMD]  (value not drawn)
TP6  TestPoint_SMD  [TestPointSMD]  (value not drawn)
TP7  TestPoint_SMD  [TestPointSMD]  (value not drawn)
TP8  TestPoint_SMD  [TestPointSMD]  (value not drawn)
TP9  TestPoint_SMD  [TestPointSMD]  (value not drawn)
TP10  TestPoint_SMD  [TestPointSMD]  (value not drawn)
TP11  TestPoint_SMD  [TestPointSMD]  (value not drawn)
TP12  TestPoint_SMD  [TestPointSMD]  (value not drawn)
TP13  TestPoint_SMD  [TestPointSMD]  (value not drawn)
U3  LM358AM  [D0008A_N]  (parts A,B of 2)
U4  LM358AM  [D0008A_N]  (parts A,B of 2)
U5  SN74LVC1G17DBVR  [DBV0005A_L]  (parts A,B of 2)
VR1  4.7k Variable Resistor  [VG039NCHXTB472]

### Ports
LEM_BUFFERED (out), LEM_BUFFERED_REF (out), LEM_OUTPUT_12V (out), LEM_TRIGGERED (out), SHDN_BSPD_TEST (in)

### Nets
+5: J2.4 R11.2 U3.8(V+) U4.8(V+) U5.5(VCC) VR1.1
+12: J2.3 Q4.3(S) R9.2
GND: C1.2 D1.1(A) D2.2(A) DS2.2(C) J2.5 Q3.2(S) Q5.2(S) R6.1 R8.1 R12.1 U3.4(GND) U4.4(GND) U5.3(GND) VR1.3
LEM_BUFFERED: TP6.1 U3.1(OUTA) U3.2(INA-) U4.3(INA+) ; port LEM_BUFFERED
LEM_BUFFERED_REF: TP7.1 U3.6(INB-) U3.7(OUTB) ; port LEM_BUFFERED_REF
LEM_MEASUREMENT: J2.2 R6.2 TP8.1 U3.3(INA+)
LEM_RESISTOR: J3.2 Q3.3(D)
LEM_SIM: R11.1 R12.2 TP12.1 U4.2(INA-) VR1.2
LEM_SIM_N: J2.6 J3.1
LEM_VREF: J2.1 TP5.1 U3.5(INB+)
NetC1_1: C1.1 D1.2(K) D2.1(K) Q3.1(G) R7.1 R8.2 TP9.1
NetDS2_1: DS2.1(A) R10.1
NetJ4_2: R7.2 ; port SHDN_BSPD_TEST
NetJ4_9: Q4.2(D) TP13.1 ; port LEM_OUTPUT_12V
NetQ4_1: Q4.1(G) Q5.3(D) R9.1
NetQ5_1: Q5.1(G) TP11.1 U5.4(Y)
NetR10_2: R10.2 TP10.1 U4.1(OUTA) U5.2(A) ; port LEM_TRIGGERED
NetU4_6: U4.6(INB-) U4.7(OUTB)

Not connected (* = marked no-connect by the designer): U4 5(INB+)*; U5 1(NC)

### Notes on the sheet
- Current Sensor
- LEM HASS 400-S
- +5V
- GND
- VREF
- Coil
- SENSOR
- P
- N
- Current Sensor Diagram
- Current Sensor Connector + Coil
- Input Buffering
- Current Generation Resistor Selection (5kW Sim)
- 5kW @ 100V (Nominal) = 50A
- 12V Signal
- 5V Signal
- Turns
- 1
- 2
- Required
- 50A
- 25A
- Current
- 0.24Ω
- Resistance
- @ 12V
- 0.48Ω
- 600
- Wattage
- 300
- @ 14.4V
- 0.288Ω
- 0.576Ω
- 720
- 360
- Wire Rating
- AWG 10
- AWG 15
- 5
- 10
- 20
- 50
- 75
- 10A
- 5A
- 2.5A
- 1A
- 660mA
- 1.2Ω
- 2.4Ω
- 4.8Ω
- 12Ω
- 18Ω
- 120
- 60
- 30
- 12
- 8
- 1.44Ω
- 2.88Ω
- 5.76Ω
- 14.4Ω
- 21.6Ω
- 144
- 72
- 36
- 14.4
- 9.6
- AWG 20
- AWG 22
- AWG 25
- AWG 29
- AWG 31
- 100
- 125
- 150
- 200
- 500mA
- 400mA
- 333mA
- 250mA
- 24Ω
- 30Ω
- 36Ω
- 48Ω
- 6
- 4.6
- 4
- 3
- 28.8Ω
- 43.2Ω
- 57.6Ω
- 7.2
- 5.76
- 4.8
- 3.6
- AWG 32
- AWG 33
- AWG 34
- AWG 35
- Shutdown Button Input Protection
- Current Coil Trigger
- Terminated Op-Amp
- 5kW Draw Detection
- Op Amp Compartor Guide
- If VIN (+) > VREF (-) ? 5V : 0V
- If VIN (+) < VREF (-) ? 0V : 5V
- LEM Detection Indicator
- LEM Detection Inverter
- ON when not in error
- LEM Buffer to 12V
- LEM Sensor HASS-400S
- Datasheet
- LEM Sensor HASS-200S
- https://www.lem.com/sites/default/files/products_datasheets/hass_50_600-s.pdf
- https://www.lem.com/en/hass-400s
- https://www.lem.com/en/hass-200s
- Title
- Size:
- A4
- Number:
- Revision:
- QUT Motorsport, O-120
- O Block, QUT Gardens Point
- Date:
- Time:
- Sheet
- of
- Brisbane, QLD, Australia
- (in symbol TestPoint_SMD) SMD

### Library data of the parts
C1 = CMP-1035-02591-1: as C7 on sheet MCU; Rated Voltage: 50 V; Max Thickness: 1 mm; Technology: SMT; Value: 100nF
D1 = CMP-2000-05976-1: Surface Mount Zener Diode, 5.1 V, -65 to 150 degC, 2-Pin SMD (SOD-123), RoHS, Tape and Reel; Manufacturer: DiodesIncorporated; Unit Weight: 0.000353oz; Zz - Zener Impedance: 60Ohms; Vz - Zener Voltage: 5.1V; Pd - Power Dissipation: 500mW; Zener Current: 5mA; Ir - Reverse Current: 2uA; Voltage Temperature Coefficient: -0.75mV/C; Configuration: Single; Voltage Tolerance: 6%; Height: 1.35mm; Width: 1.7mm; Minimum Operating Temperature: -65C; Series: BZT52C5; Package Description: 2-Pin Surface Mount Device, Body 2.7 x 1.55 mm; Length: 2.85mm; Mounting Technology: SurfaceMount; Brand: DiodesIncorporated; Factory Pack Quantity: 3000; Product Category: ZenerDiodes; RoHS: True; Manufacturer URL: http://www.diodes.com/; Termination Style: SMD/SMT; Package / Case: SOD-123; Packaging: Reel; Package Reference: SOD123; Datasheet Version: Rev. 37-2, 09/2012; Maximum Operating Temperature: +150C; Datasheet URL: http://www.diodes.com/_files/datasheets/ds18004.pdf; Mounting Style: SMD/SMT
D2 = CMP-1063-00102-1: Transient Voltage Suppressor, Micro-Packaged Diode for ESD Protection, 2-Pin SOD-523, Pb-Free, Tape and Reel; Manufacturer: On Semiconductor; V(BR) Min (V): 6.2; VRWM Max (V): 5; Number of Lines: 1; PPK Max (W): 174; IR Max (uA): 0.05; Direction: Unidirectional; PackageVersion: Rev. E, 09/2010; Mounting Technology: Surface Mount; Packing: Tape and Reel; ComponentLink2URL: http://www.onsemi.cn/pub_link/Collateral/ESD5Z2.5T1-D.PDF; ComponentLink2Description: Datasheet; PackageReference: SOD-523-2-502-01; ComponentLink1Description: Manufacturer URL; ComponentLink3URL: http://www.onsemi.com/pub_link/Collateral/502-01.PDF; PackageDescription: 2-Pin SOD, Body 1.2 x 0.8 mm; ComponentLink3Description: Package Specification; ComponentLink1URL: http://www.onsemi.com/; RoHS: Pb-Free; PartNumber: ESD5Z5.0T1G; DatasheetVersion: Rev. 10
J2 = Microfit_2x3
J3 = Microfit_1x2
Q3 Q5 = CMP-1058-00774-1: as Q2 on sheet IMD; Package Type: SOT-23-3; ComponentLink1URL: http://www.onsemi.com/; ComponentLink2Description: Datasheet; ComponentLink1Description: Manufacturer URL; Mounting Technology: Surface Mount; Configuration: Single; Packing: Tape and Reel; RoHS: Pb-Free; ComponentLink3URL: http://www.onsemi.cn/pub_link/Collateral/318-08.PDF; PackageVersion: Rev. AP, 11/2009; PackageReference: SOT-23-3-318-08; DatasheetVersion: Rev. 1; PackageDescription: 3-Pin Small Outline Transistor, Body 2.92 x 1.3 mm, Pitch 0.95 mm; ComponentLink3Description: Package Specification; ComponentLink2URL: http://www.onsemi.com/pub_link/Collateral/NVR5198NL-D.PDF; PartNumber: NVR5198NLT1G
Q4 = CMP-2000-05431-1: as Q1 on sheet IMD; Mounting Style: SMD/SMT; Package / Case: TO-252AA-3; Height: 2.39mm; Datasheet Version: Rev. C, 07/2013; Factory Pack Quantity: 2000; RoHS: True; Typical Turn-Off Delay Time: 175ns; Minimum Operating Temperature: -55C; Tradename: TrenchFET; Manufacturer URL: http://www.vishay.com/; Package Description: 3-Pin Surface Mount Device, Body 6.54 x 6.095 mm, Pitch 2.28 mm; Package Reference: TO-252; Transistor Polarity: P-Channel; Technology: Si; Series: SUD; Datasheet URL: https://datasheet.ciiva.com/4444/sud50p06-244530-4444327.pdf; Width: 6.22mm; Product Category: MOSFET; Packaging: Reel; Length: 6.73mm; Package URL: http://www.vishay.com/docs/89975/v15wl45c-m3.pdf; Maximum Operating Temperature: +150C
R6 R9 R10 = CMP-1012-00074-1: as R24 on sheet MCU; Technology: SMT; Tolerance: 5 %; Power: 0.1 W
R7 = CMP-1012-00098-1: as R23 on sheet MCU; Technology: SMT; Tolerance: 5 %; Power: 0.1 W
R8 = CMP-1012-00090-1: 4K7 0.1W 5% 0603 (1608 Metric)  SMD; Case-Metric: 1608; Value: 4700.00 Ohm; Case-EIA: 0603; Tolerance: 5 %; Technology: SMT; Power: 0.1 W
R11 R12 = CMP-1591-00001-1: 0603 (1608 Metric) Chip Resistor; Case-Metric: 1608; Case-EIA: 0603; PackageReference: RESC0603(1608)
U3 U4 = CMP-0055-00796-3: as U1 on sheet IMD; Code_JEDEC: MS-012-AA; RoHS: N; PinCount: 8; Package Reference: D0008A; ComponentLink1Description: Datasheet URL; ComponentLink1URL: http://www.ti.com/general/docs/lit/getliterature.tsp?genericPartNumber=LM358-N&fileType=pdf; Code_IPC: SOIC127P600-8; PackageDescription: SOIC Narrow, 4.9 x 3.9 x 1.45mm, 8 Lead, 1.27mm Pitch
U5 = CMP-0859-00033-4: as U2 on sheet IMD; PackageReference: DBV0005A; DatasheetVersion: SCES351V; Generic Part Number: SN74LVC1G17; Operating Temperature Range(C): -40 to 125,-40 to 85
VR1 = 4.7k Variable Resistor: 4k7 ±25% ±250 ppm/°C SMD Variable Resistors RoHS | VG039NCHXTB472; ComponentLink1Description: LCSC; ComponentLink1URL: https://lcsc.com/product-detail/Variable-Resistors_HDK-Hokuriku-Elec-Industry-VG039NCHXTB472_C128555.html

## Sheet CAN.SchDoc: QUTMS - HVBoard V1.1 - CANBUS
size A4; Author: Jonn Dillon; Organization: QUT Motorsport; Address1: O-120; Address2: O Block; Address3: QUT Gardens Point; Address4: Brisbane, 4000; DocumentNumber: 6; SheetNumber: 6; SheetTotal: 8
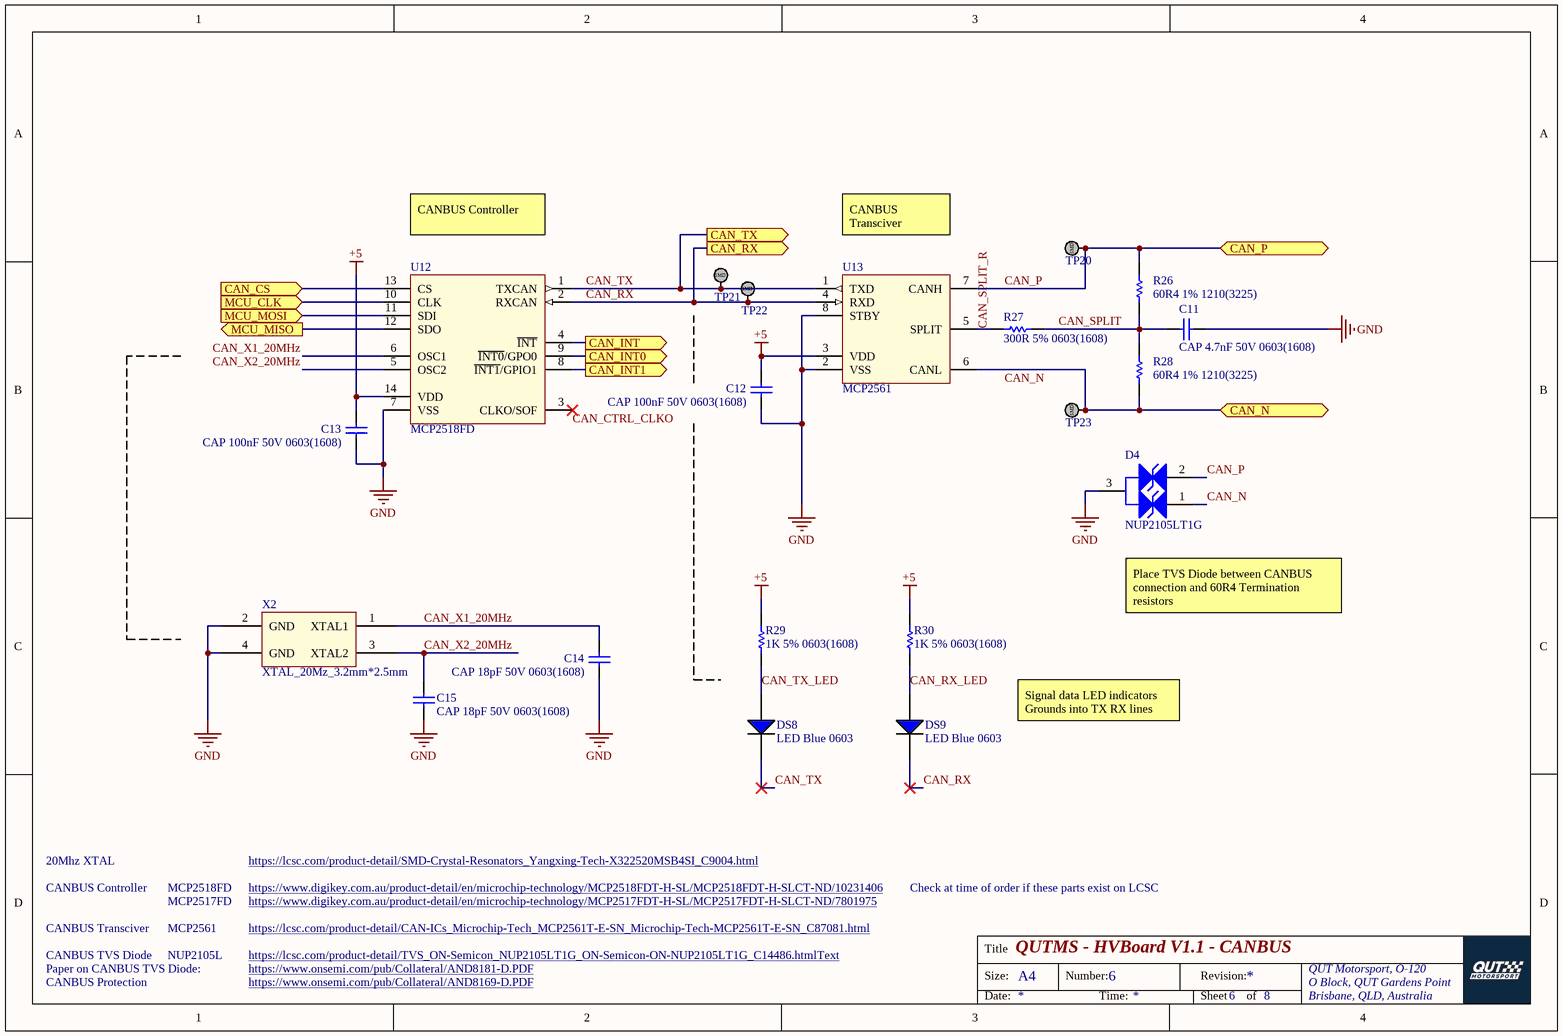
[diagram p5: CAN.SchDoc]

### Parts
C11  CAP 4.7nF 50V 0603(1608)  [CAPC0603(1608)100_M]
C12  CAP 100nF 50V 0603(1608)  [CAPC0603(1608)100_L]
C13  CAP 100nF 50V 0603(1608)  [CAPC0603(1608)100_L]
C14  CAP 18pF 50V 0603(1608)  [CAPC0603(1608)100_L]
C15  CAP 18pF 50V 0603(1608)  [CAPC0603(1608)100_L]
D4  NUP2105LT1G  [ONSC-SOT-23-3-318-08_V]
DS8  LED Blue 0603  [LED BLUE 0603]
DS9  LED Blue 0603  [LED BLUE 0603]
R26  60R4 1% 1210(3225)  [RESC1210(3225)_L]
R27  300R 5% 0603(1608)  [RESC0603(1608)_N]
R28  60R4 1% 1210(3225)  [RESC1210(3225)_L]
R29  1K 5% 0603(1608)  [RESC0603(1608)_L]
R30  1K 5% 0603(1608)  [RESC0603(1608)_L]
TP20  TestPoint_SMD  [TestPointSMD]  (value not drawn)
TP21  TestPoint_SMD  [TestPointSMD]  (value not drawn)
TP22  TestPoint_SMD  [TestPointSMD]  (value not drawn)
TP23  TestPoint_SMD  [TestPointSMD]  (value not drawn)
U12  MCP2518FD  [MCP2517FD SOIC]
U13  MCP2561  [MCP2561 SOIC]
X2  XTAL_20Mz_3.2mm*2.5mm  [3.2mm*2.5mm]

### Ports
CAN_CS (in), CAN_INT0 (out), CAN_INT1 (out), CAN_INT (out), CAN_N (bidir), CAN_P (bidir), CAN_RX (out), CAN_TX (out), MCU_CLK (in), MCU_MISO (out), MCU_MOSI (in)

### Nets
+5: C12.2 C13.2 R29.2 R30.2 U12.14(VDD) U13.3(VDD)
GND: C11.1 C12.1 C13.1 C14.1 C15.1 D4.3(K) U12.7(VSS) U13.2(VSS) U13.8(STBY) X2.2(GND) X2.4(GND)
CAN_CS: U12.13(CS) ; port CAN_CS
CAN_CTRL_CLKO: U12.3(CLKO/SOF)
CAN_INT: U12.4(~{INT}) ; port CAN_INT
CAN_INT0: U12.9(~{INT0}/GPO0) ; port CAN_INT0
CAN_INT1: U12.8(~{INT1}/GPIO1) ; port CAN_INT1
CAN_N: D4.1(K) R28.1 TP23.1 U13.6(CANL) ; port CAN_N
CAN_P: D4.2(K) R26.2 TP20.1 U13.7(CANH) ; port CAN_P
CAN_RX: DS9.2(C) TP22.1 U12.2(RXCAN) U13.4(RXD) ; port CAN_RX
CAN_RX_LED: DS9.1(A) R30.1
CAN_SPLIT: C11.2 R26.1 R27.2 R28.2
CAN_SPLIT_R: R27.1 U13.5(SPLIT)
CAN_TX: DS8.2(C) TP21.1 U12.1(TXCAN) U13.1(TXD) ; port CAN_TX
CAN_TX_LED: DS8.1(A) R29.1
CAN_X1_20MHz: C14.2 U12.6(OSC1) X2.1(XTAL1)
CAN_X2_20MHz: C15.2 U12.5(OSC2) X2.3(XTAL2)
MCU_CLK: U12.10(CLK) ; port MCU_CLK
MCU_MISO: U12.12(SDO) ; port MCU_MISO
MCU_MOSI: U12.11(SDI) ; port MCU_MOSI

### Notes on the sheet
- CANBUS Controller
- CANBUS Transciver
- Place TVS Diode between CANBUS connection and 60R4 Termination resistors
- Signal data LED indicators
  Grounds into TX RX lines
- 20Mhz XTAL
- MCP2518FD
- MCP2517FD
- https://www.digikey.com.au/product-detail/en/microchip-technology/MCP2518FDT-H-SL/MCP2518FDT-H-SLCT-ND/10231406
- https://www.digikey.com.au/product-detail/en/microchip-technology/MCP2517FDT-H-SL/MCP2517FDT-H-SLCT-ND/7801975
- https://lcsc.com/product-detail/SMD-Crystal-Resonators_Yangxing-Tech-X322520MSB4SI_C9004.html
- Check at time of order if these parts exist on LCSC
- Paper on CANBUS TVS Diode:
- CANBUS TVS Diode
- CANBUS Protection
- MCP2561
- NUP2105L
- https://www.onsemi.com/pub/Collateral/AND8181-D.PDF
- https://lcsc.com/product-detail/CAN-ICs_Microchip-Tech_MCP2561T-E-SN_Microchip-Tech-MCP2561T-E-SN_C87081.html
- https://lcsc.com/product-detail/TVS_ON-Semicon_NUP2105LT1G_ON-Semicon-ON-NUP2105LT1G_C14486.htmlText
- https://www.onsemi.com/pub/Collateral/AND8169-D.PDF
- Title
- Size:
- A4
- Number:
- Revision:
- QUT Motorsport, O-120
- O Block, QUT Gardens Point
- Date:
- Time:
- Sheet
- of
- Brisbane, QLD, Australia
- (in symbol TestPoint_SMD) SMD

### Library data of the parts
C11 = CMP-1035-02202-1: CAP 4.7nF 50V ±5% 0603 (1608 Metric) Thickness 1mm SMD; Case-Metric: 1608; Case-EIA: 0603; Tolerance: Â±5%; Value: 4.7nF; Rated Voltage: 50 V; Technology: SMT; Max Thickness: 1 mm
C12 C13 = CMP-1035-02591-1: as C7 on sheet MCU; Rated Voltage: 50 V; Max Thickness: 1 mm; Technology: SMT; Value: 100nF
C14 C15 = CMP-1035-00748-1: as C9 on sheet MCU; Max Thickness: 1 mm; Value: 18pF; Rated Voltage: 50 V; Technology: SMT
D4 = CMP-1063-00164-1: Dual Line CAN Bus Protector, 3-Pin SOT-23, Pb-Free, Tape and Reel; Manufacturer: On Semiconductor; IR Max (uA): 0.1; Number of Lines: 2; Direction: Bidirectional; C Max (pF): 30; PPK Max (W): 350; V(BR) Min (V): 26.2; ComponentLink3URL: http://www.onsemi.cn/pub_link/Collateral/318-08.PDF; Mounting Technology: Surface Mount; ComponentLink2Description: Datasheet; PartNumber: NUP2105LT1G; ComponentLink1URL: http://www.onsemi.com/; PackageVersion: Rev. AP, 11/2009; DatasheetVersion: Rev. 5; RoHS: Pb-Free; PackageReference: SOT-23-3-318-08; ComponentLink2URL: http://www.onsemi.cn/pub_link/Collateral/NUP2105L-D.PDF; ComponentLink1Description: Manufacturer URL; PackageDescription: 3-Pin Small Outline Transistor, Body 2.92 x 1.3 mm, Pitch 0.95 mm; Packing: Tape and Reel; ComponentLink3Description: Package Specification
R26 R28 = CMP-1015-00372-1: 60R4 0.5W 1% 1210 (3225 Metric)  SMD; Case-Metric: 3225; Case-EIA: 1210; Value: 60.40 Ohm; Technology: SMT; Tolerance: 1 %; Power: 0.5 W
R27 = CMP-1012-00061-1: 300R 0.1W 5% 0603 (1608 Metric)  SMD; Case-EIA: 0603; Value: 300.00 Ohm; Case-Metric: 1608; Tolerance: 5 %; Power: 0.1 W; Technology: SMT
R29 R30 = CMP-1012-00074-1: as R24 on sheet MCU; Technology: SMT; Tolerance: 5 %; Power: 0.1 W
X2 = XTAL_20Mz_3.2mm*2.5mm: ComponentLink1Description: LCSC; ComponentLink1URL: https://lcsc.com/product-detail/SMD-Crystal-Resonators_Yangxing-Tech-X322520MSB4SI_C9004.html

## Sheet TSAL.SchDoc: QUTMS - HVBoard V1.1- TSAL
size A3; Author: Jonn Dillon; Organization: QUT Motorsport; Address1: O-120; Address2: O Block; Address3: QUT Gardens Point; Address4: Brisbane, 4000; DocumentNumber: 4; Revision: 2; SheetNumber: 4; SheetTotal: 8
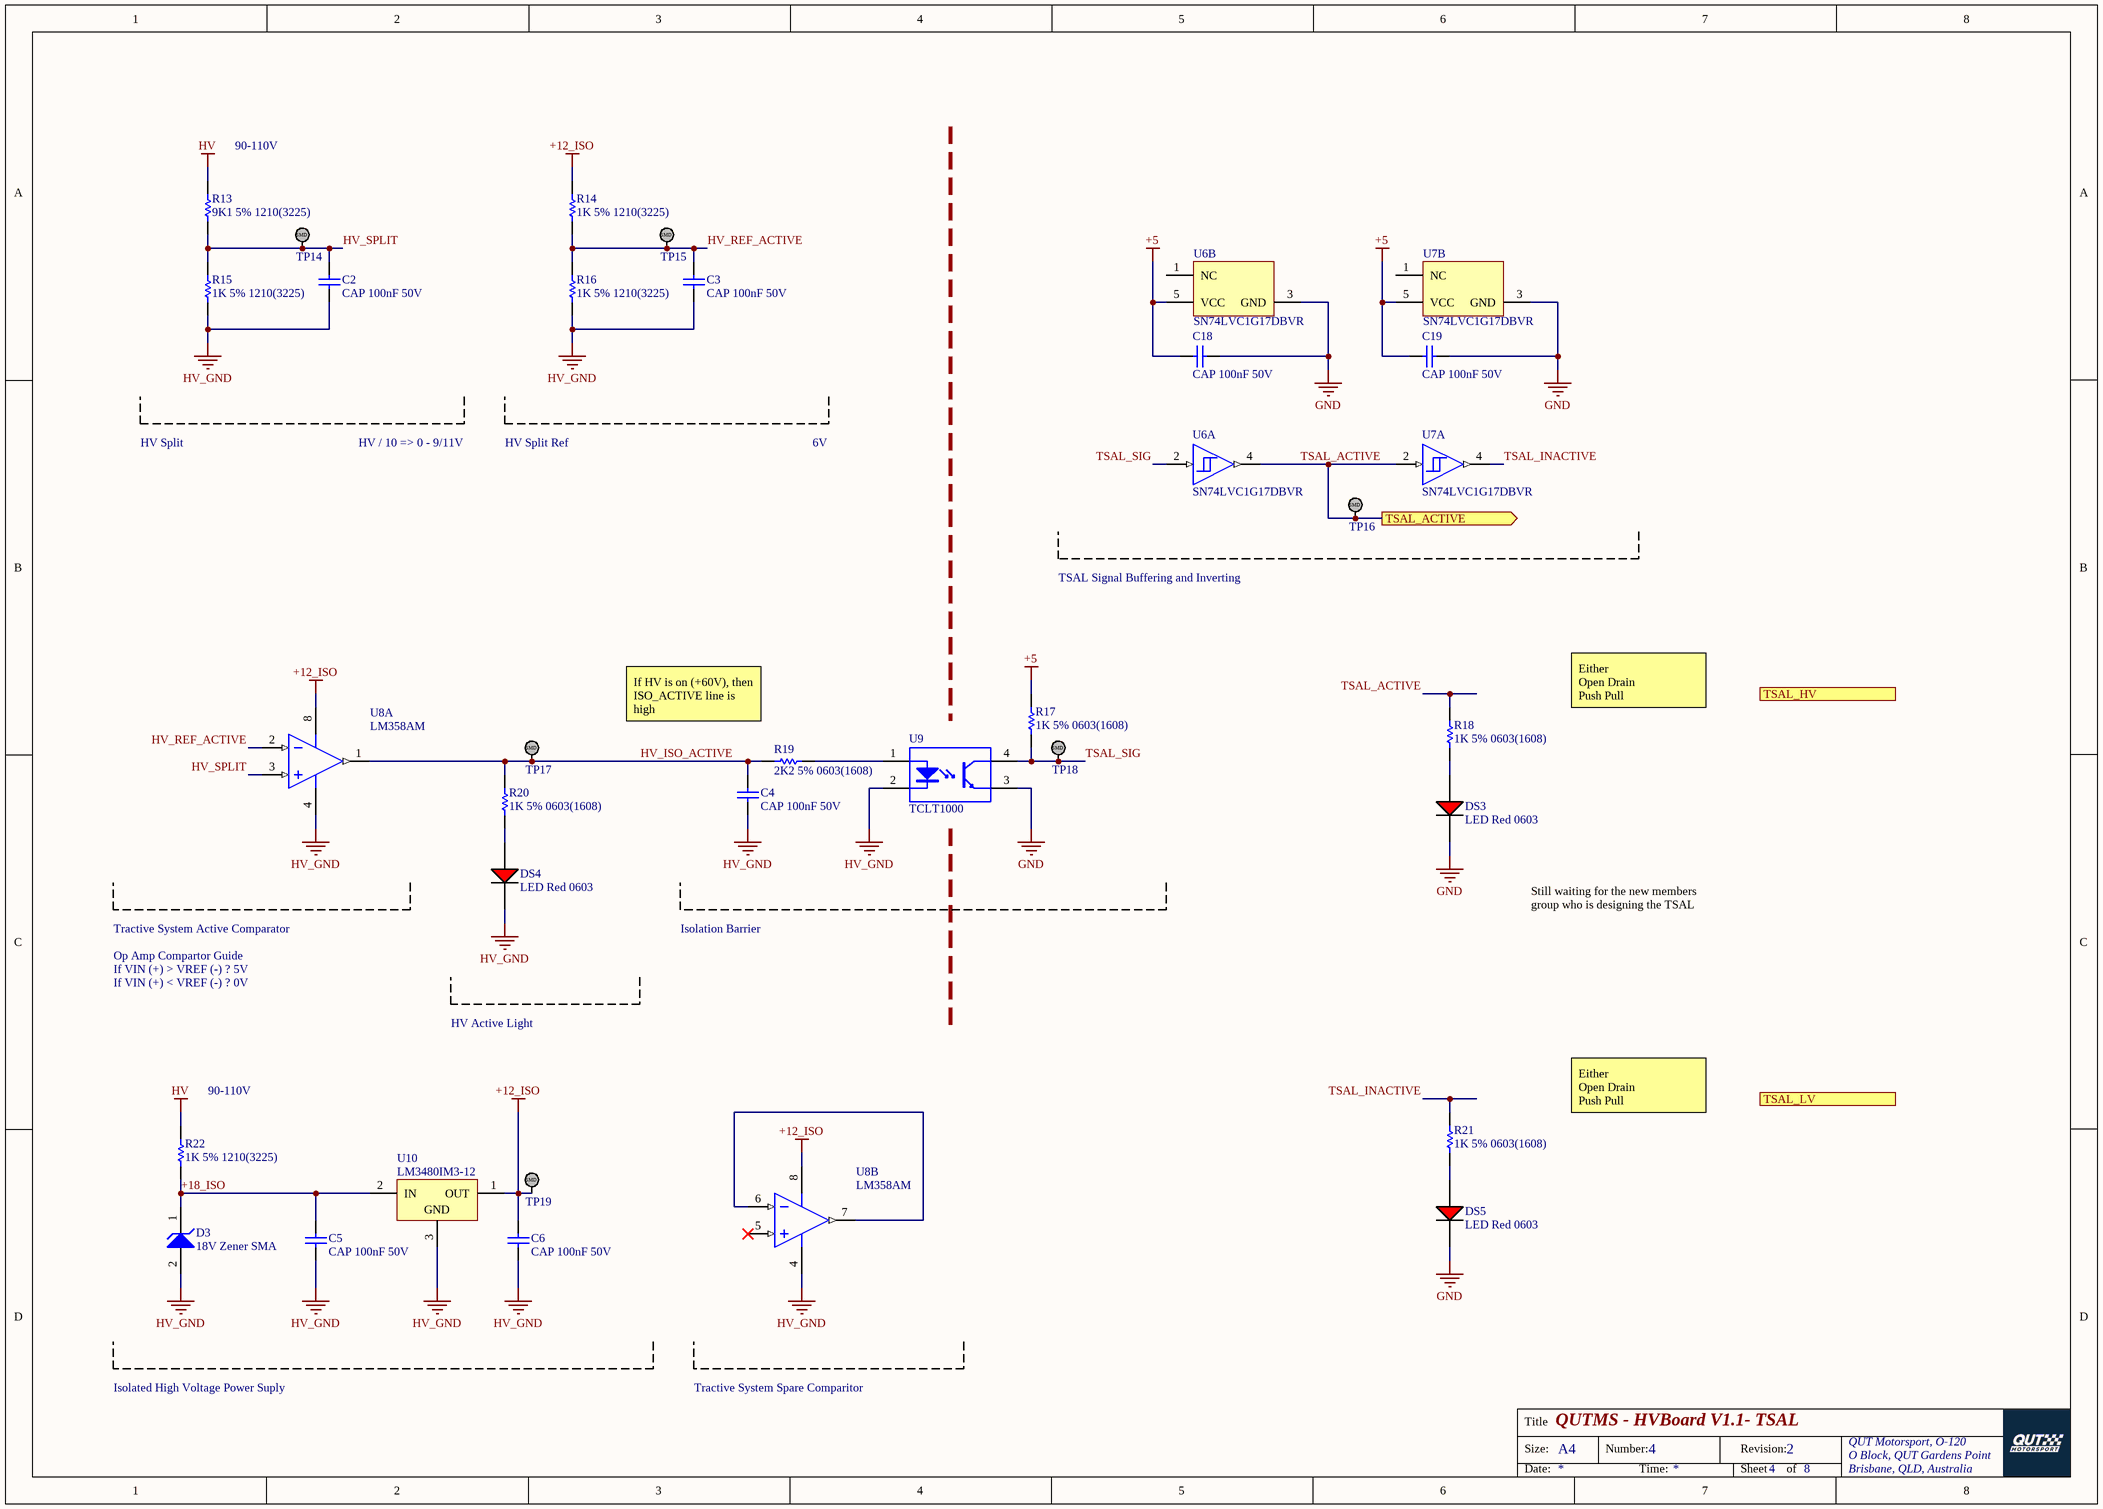
[diagram p6: TSAL.SchDoc]

### Parts
C2  CAP 100nF 50V  [CAPC0603(1608)100_N]
C3  CAP 100nF 50V  [CAPC0603(1608)100_N]
C4  CAP 100nF 50V  [CAPC0603(1608)100_N]
C5  CAP 100nF 50V  [CAPC0603(1608)100_N]
C6  CAP 100nF 50V  [CAPC0603(1608)100_N]
C18  CAP 100nF 50V  [CAPC0603(1608)100_N]
C19  CAP 100nF 50V  [CAPC0603(1608)100_N]
D3  18V Zener SMA  [ONSC-SMA-2-403D-02_F_V]
DS3  LED Red 0603  [LED RED 0603]
DS4  LED Red 0603  [LED RED 0603]
DS5  LED Red 0603  [LED RED 0603]
R13  9K1 5% 1210(3225)  [RESC1210(3225)_N]
R14  1K 5% 1210(3225)  [RESC1210(3225)_N]
R15  1K 5% 1210(3225)  [RESC1210(3225)_N]
R16  1K 5% 1210(3225)  [RESC1210(3225)_N]
R17  1K 5% 0603(1608)  [RESC0603(1608)_L]
R18  1K 5% 0603(1608)  [RESC0603(1608)_N]
R19  2K2 5% 0603(1608)  [RESC0603(1608)_N]
R20  1K 5% 0603(1608)  [RESC0603(1608)_N]
R21  1K 5% 0603(1608)  [RESC0603(1608)_N]
R22  1K 5% 1210(3225)  [RESC1210(3225)_N]
TP14  TestPoint_SMD  [TestPointSMD]  (value not drawn)
TP15  TestPoint_SMD  [TestPointSMD]  (value not drawn)
TP16  TestPoint_SMD  [TestPointSMD]  (value not drawn)
TP17  TestPoint_SMD  [TestPointSMD]  (value not drawn)
TP18  TestPoint_SMD  [TestPointSMD]  (value not drawn)
TP19  TestPoint_SMD  [TestPointSMD]  (value not drawn)
U6  SN74LVC1G17DBVR  [DBV0005A_N]  (parts A,B of 2)
U7  SN74LVC1G17DBVR  [DBV0005A_N]  (parts A,B of 2)
U8  LM358AM  [D0008A_N]  (parts A,B of 2)
U9  TCLT1000  [VISH-SOP4L-4_V]
U10  LM3480IM3-12  [DBZ0003A_N]

### Ports
TSAL_ACTIVE (out), TSAL_HV (out), TSAL_LV (out)

### Nets
+5: C18.1 C19.1 R17.2 U6.5(VCC) U7.5(VCC)
+12_ISO: C6.1 R14.2 TP19.1 U8.8(V+) U10.1(OUT)
GND: C18.2 C19.2 DS3.2(C) DS5.2(C) U6.3(GND) U7.3(GND) U9.3(E)
HV: R13.2 R22.2
HV_GND: C2.2 C3.2 C4.2 C5.2 C6.2 D3.2(A) DS4.2(C) R15.1 R16.1 U8.4(GND) U9.2(C) U10.3(GND)
+18_ISO: C5.1 D3.1(K) R22.1 U10.2(IN)
HV_ISO_ACTIVE: C4.1 R19.2 R20.2 TP17.1 U8.1(OUTA)
HV_REF_ACTIVE: C3.1 R14.1 R16.2 TP15.1 U8.2(INA-)
HV_SPLIT: C2.1 R13.1 R15.2 TP14.1 U8.3(INA+)
TSAL_ACTIVE: R18.2 TP16.1 U6.4(Y) U7.2(A) ; port TSAL_ACTIVE
TSAL_INACTIVE: R21.2 U7.4(Y)
TSAL_SIG: R17.1 TP18.1 U6.2(A) U9.4(C)
NetDS3_1: DS3.1(A) R18.1
NetDS4_1: DS4.1(A) R20.1
NetDS5_1: DS5.1(A) R21.1
NetR19_1: R19.1 U9.1(A)
NetU8_6: U8.6(INB-) U8.7(OUTB)

Not connected (* = marked no-connect by the designer): U6 1(NC); U7 1(NC); U8 5(INB+)*

### Notes on the sheet
- (near R13) 90-110V
- HV Split
- HV / 10 => 0 - 9/11V
- HV Split Ref
- 6V
- TSAL Signal Buffering and Inverting
- If HV is on (+60V), then ISO_ACTIVE line is high
- Either
  Open Drain
  Push Pull
- Still waiting for the new members group who is designing the TSAL
- Tractive System Active Comparator
- If VIN (+) > VREF (-) ? 5V
- If VIN (+) < VREF (-) ? 0V
- Op Amp Compartor Guide
- Isolation Barrier
- HV Active Light
- (near R22) 90-110V
- Isolated High Voltage Power Suply
- Tractive System Spare Comparitor
- Title
- Size:
- A4
- Number:
- Revision:
- QUT Motorsport, O-120
- O Block, QUT Gardens Point
- Date:
- Time:
- Sheet
- of
- Brisbane, QLD, Australia
- (in symbol TestPoint_SMD) SMD

### Library data of the parts
C2-C6 C18 C19 = CMP-1035-02591-1: as C7 on sheet MCU; Rated Voltage: 50 V; Max Thickness: 1 mm; Technology: SMT; Value: 100nF
D3 = CMP-1060-00118-1: 1.5 W Zener Voltage Regulator, 2-Pin SMA, Pb-Free, Tape and Reel; Manufacturer: On Semiconductor; PartNumber: 1SMA5931BT3G; VZ Typ (V): 18; Mounting Technology: Surface Mount; RoHS: Pb-Free; PackageDescription: 2-Pin Small Molded Package, J-Bend Lead, Body 2.605 x 4.315 mm; ComponentLink2Description: Datasheet; DatasheetVersion: Rev. 8; ComponentLink2URL: http://www.onsemi.com/pub_link/Collateral/1SMA5913BT3-D.PDF; ComponentLink3URL: http://www.onsemi.com/pub_link/Collateral/1SMA5913BT3-D.PDF; ComponentLink1URL: http://www.onsemi.com/; ComponentLink1Description: Manufacturer URL; Packing: Tape and Reel; ComponentLink3Description: Package Specification; PackageVersion: Rev. F, 11/2008; PackageReference: SMA-2-403D-02_F
R13 = CMP-1015-00097-1: 9K1 0.5W 5% 1210 (3225 Metric)  SMD; Case-EIA: 1210; Value: 9100.00 Ohm; Case-Metric: 3225; Technology: SMT; Power: 0.5 W; Tolerance: 5 %
R14-R16 R22 = CMP-1015-00074-1: 1K 0.5W 5% 1210 (3225 Metric)  SMD; Case-EIA: 1210; Value: 1000.00 Ohm; Case-Metric: 3225; Power: 0.5 W; Technology: SMT; Tolerance: 5 %
R17 R18 R20 R21 = CMP-1012-00074-1: as R24 on sheet MCU; Technology: SMT; Tolerance: 5 %; Power: 0.1 W
R19 = CMP-1012-00082-1: as R2 on sheet IMD; Power: 0.1 W; Tolerance: 5 %; Technology: SMT
U6 U7 = CMP-0859-00033-4: as U2 on sheet IMD; PackageReference: DBV0005A; DatasheetVersion: SCES351V; Generic Part Number: SN74LVC1G17; Operating Temperature Range(C): -40 to 125,-40 to 85
U8 = CMP-0055-00796-3: as U1 on sheet IMD; Code_JEDEC: MS-012-AA; RoHS: N; PinCount: 8; Package Reference: D0008A; ComponentLink1Description: Datasheet URL; ComponentLink1URL: http://www.ti.com/general/docs/lit/getliterature.tsp?genericPartNumber=LM358-N&fileType=pdf; Code_IPC: SOIC127P600-8; PackageDescription: SOIC Narrow, 4.9 x 3.9 x 1.45mm, 8 Lead, 1.27mm Pitch
U9 = CMP-2000-07234-1: Optocoupler, Phototransistor Output, VCEO 70 V, -55 to 100 degC, 4-Pin SOP (SOP4L), RoHS, Tape and Reel; Manufacturer: Vishay/Semiconductor; Maximum Collector Emitter Voltage: 70V; Input Type: DC; Maximum Reverse Voltage: 6V; Maximum Collector Emitter Saturation Voltage: 300mV; Number of Channels per Chip: 1; Maximum Collector Current: 50mA; Maximum Power Dissipation: 250mW; Maximum Forward Voltage: 1.6V; Maximum Input Current: 60mA; Typical Forward Voltage: 1.25V; Minimum Isolation Voltage: 5000Vrms; Maximum Current Transfer Ratio @ Current: 600%; Manufacturer URL: http://www.vishay.com/; Package: 4SOP; Mounting Technology: SurfaceMount; Category: TransistorandPhotovoltaicOutputPhotoCouplers; Datasheet URL: http://www.vishay.com/docs/83515/tclt1000.pdf; Output Type: DC; Operating Temperature: -40to100°C; Package Description: 4-Pin Small Outline Package Integrated Circuit, Body 4.1 x 7.5 mm, Pitch 2.54 mm; Datasheet Version: Rev. 2.9, 12/2015; Package Reference: SOP4L; Packaging: Tape&Reel
U10 = CMP-0062-02197-3: 100 mA, Quasi Low-Dropout Linear Voltage Regulator, 3-pin SOT-23, Pb-Free; Manufacturer: Texas Instruments; PackageTopMarking: L0C*XTT; CompType: LDO IC; PowerWise: N; PackageDescription: Molded SOT-23, .115 x .051 x .037in Body, 3 Lead, .075 in Pitch; ComponentLink1Description: Datasheet URL; PackageReference: DBZ0003A; ComponentLink1URL: http://www.ti.com/general/docs/lit/getliterature.tsp?genericPartNumber=LM3480&fileType=pdf; RoHS: Y; PinCount: 3

## Sheet Power.SchDoc: QUTMS - HV Board V1.1 - Power
size A4; Author: Jonn Dillon; Organization: QUT Motorsport; Address1: O-120; Address2: O Block; Address3: QUT Gardens Point; Address4: Brisbane, 4000; DocumentNumber: 7; Revision: 2; SheetNumber: 7; SheetTotal: 8
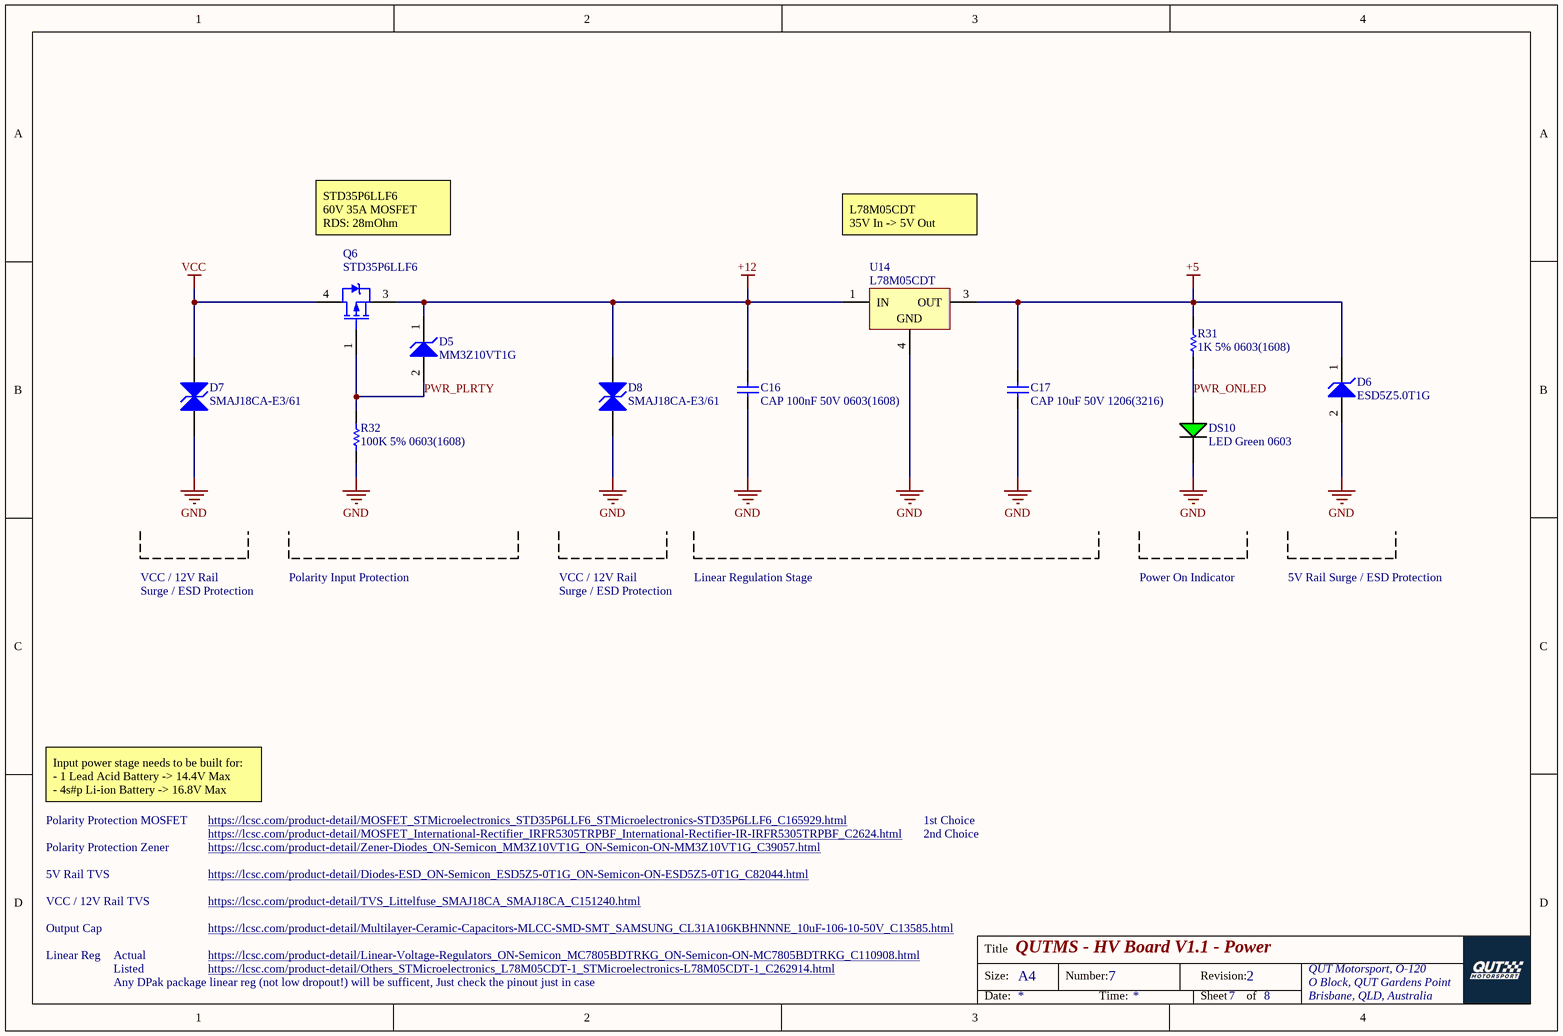
[diagram p7: Power.SchDoc]

### Parts
C16  CAP 100nF 50V 0603(1608)  [CAPC0603(1608)100_N]
C17  CAP 10uF 50V 1206(3216)  [CAPC1206(3216)190_N]
D5  MM3Z10VT1G  [ONSC-SOD-323-2-477-02_V]
D6  ESD5Z5.0T1G  [ONSC-SOD-523-2-502-01_V]
D7  SMAJ18CA-E3/61  [VISH-DO-214AC-2_N]
D8  SMAJ18CA-E3/61  [VISH-DO-214AC-2_N]
DS10  LED Green 0603  [LED GREEN 0603]
Q6  STD35P6LLF6  [ONSC-DPAK-3-369C-01_V]
R31  1K 5% 0603(1608)  [RESC0603(1608)_N]
R32  100K 5% 0603(1608)  [RESC0603(1608)_N]
U14  L78M05CDT  [STM-TO252-3_A_V]

### Nets
+5: C17.2 D6.1(K) R31.2 U14.3(OUT)
+12: C16.2 D5.1(K) D8.2(A2) Q6.3(S) U14.1(IN)
GND: C16.1 C17.1 D6.2(A) D7.1(A1) D8.1(A1) DS10.2(C) R32.1 U14.4(GND)
VCC: D7.2(A2) Q6.4(D)
PWR_ONLED: DS10.1(A) R31.1
PWR_PLRTY: D5.2(A) Q6.1(G) R32.2

### Notes on the sheet
- STD35P6LLF6
  60V 35A MOSFET
  RDS: 28mOhm
- L78M05CDT
  35V In -> 5V Out
- VCC / 12V Rail
- Polarity Input Protection
- Linear Regulation Stage
- Power On Indicator
- 5V Rail Surge / ESD Protection
- Surge / ESD Protection
- Polarity Protection MOSFET
- Polarity Protection Zener
- Input power stage needs to be built for:
  - 1 Lead Acid Battery -> 14.4V Max
  - 4s#p Li-ion Battery -> 16.8V Max
- https://lcsc.com/product-detail/MOSFET_International-Rectifier_IRFR5305TRPBF_International-Rectifier-IR-IRFR5305TRPBF_C2624.html
- https://lcsc.com/product-detail/Zener-Diodes_ON-Semicon_MM3Z10VT1G_ON-Semicon-ON-MM3Z10VT1G_C39057.html
- https://lcsc.com/product-detail/MOSFET_STMicroelectronics_STD35P6LLF6_STMicroelectronics-STD35P6LLF6_C165929.html
- 1st Choice
- 2nd Choice
- 5V Rail TVS
- VCC / 12V Rail TVS
- https://lcsc.com/product-detail/Diodes-ESD_ON-Semicon_ESD5Z5-0T1G_ON-Semicon-ON-ESD5Z5-0T1G_C82044.html
- https://lcsc.com/product-detail/TVS_Littelfuse_SMAJ18CA_SMAJ18CA_C151240.html
- Linear Reg
- Output Cap
- Actual
- Listed
- Any DPak package linear reg (not low dropout!) will be sufficent, Just check the pinout just in case
- https://lcsc.com/product-detail/Multilayer-Ceramic-Capacitors-MLCC-SMD-SMT_SAMSUNG_CL31A106KBHNNNE_10uF-106-10-50V_C13585.html
- https://lcsc.com/product-detail/Linear-Voltage-Regulators_ON-Semicon_MC7805BDTRKG_ON-Semicon-ON-MC7805BDTRKG_C110908.html
- https://lcsc.com/product-detail/Others_STMicroelectronics_L78M05CDT-1_STMicroelectronics-L78M05CDT-1_C262914.html
- Title
- Size:
- A4
- Number:
- Revision:
- QUT Motorsport, O-120
- O Block, QUT Gardens Point
- Date:
- Time:
- Sheet
- of
- Brisbane, QLD, Australia

### Library data of the parts
C16 = CMP-1035-02591-1: as C7 on sheet MCU; Rated Voltage: 50 V; Max Thickness: 1 mm; Technology: SMT; Value: 100nF
C17 = CMP-1037-04982-1: CAP 10uF 50V ±10% 1206 (3216 Metric) Thickness 1.9mm SMD; Case-EIA: 1206; Tolerance: Â±10%; Case-Metric: 3216; Technology: SMT; Max Thickness: 1.9 mm; Value: 10uF; Rated Voltage: 50 V
D5 = CMP-1060-00715-1: Zener Voltage Regulator, 300 mW, 2-Pin SOD-323, Pb-Free, Tape and Reel; Manufacturer: On Semiconductor; VZ Typ (V): 10; P Max (W): 0.3; ComponentLink1Description: Manufacturer URL; DatasheetVersion: Rev. 9; PartNumber: MM3Z10VT1G; PackageDescription: 2-Pin SOD, Body 1.7 x 1.25 mm; Packing: Tape and Reel; ComponentLink1URL: http://www.onsemi.com/; PackageReference: SOD-323-2-477-02; PackageVersion: Rev. H, 03/2007; ComponentLink3URL: http://www.onsemi.com/pub_link/Collateral/477-02.PDF.1; Mounting Technology: Surface Mount; RoHS: Pb-Free; ComponentLink2URL: http://www.onsemi.cn/pub_link/Collateral/MM3Z2V4T1-D.PDF; ComponentLink3Description: Package Specification; ComponentLink2Description: Datasheet
D6 = CMP-1063-00102-1: as D2 on sheet LEM; PackageVersion: Rev. E, 09/2010; Mounting Technology: Surface Mount; Packing: Tape and Reel; ComponentLink2URL: http://www.onsemi.cn/pub_link/Collateral/ESD5Z2.5T1-D.PDF; ComponentLink2Description: Datasheet; PackageReference: SOD-523-2-502-01; ComponentLink1Description: Manufacturer URL; ComponentLink3URL: http://www.onsemi.com/pub_link/Collateral/502-01.PDF; PackageDescription: 2-Pin SOD, Body 1.2 x 0.8 mm; ComponentLink3Description: Package Specification; ComponentLink1URL: http://www.onsemi.com/; RoHS: Pb-Free; PartNumber: ESD5Z5.0T1G; DatasheetVersion: Rev. 10
D7 D8 = CMP-0548-00180-2: Transient Voltage Suppressor, 6.40 to 231 V, 18 V Stand-off Voltage, Bi-Directional, -55 to 155 degC, 2-pin DO-214AC, Pb-Free, Tape and Reel; Manufacturer: Vishay Semiconductor; VWM (V): 18; IFSM: 40 A; VBR Bi-Directional (V): 6.4 to 231; ID (uA): 2; PPPM (W): 400, 300; PackageDescription: 2-Pin DO-214AC (SMA), Body 4.245 x 2.665 mm; ComponentLink1Description: Manufacturer URL; RoHS: TRUE; ComponentLink3Description: Package Specification; ComponentLink3URL: http://www.vishay.com/docs/88390/smaj50a.pdf; Mounting Technology: Surface Mount; DatasheetVersion: 12/8/2013; ComponentLink1URL: http://www.vishay.com/; ComponentLink2URL: http://www.vishay.com/docs/88390/smaj50a.pdf; PackageReference: DO-214AC-2; ComponentLink2Description: Datasheet; PartNumber: SMAJ18CA-E3/61; Packing: Tape and Reel; Operating Junction and Storage Temperature Range: -55 to 150 degC
Q6 = CMP-1058-00390-1: Power MOSFET, -60 V, -12 A, P-Channel, 3-Pin DPAK, Pb-Free, Tape and Reel; Manufacturer: On Semiconductor; PartNumber: NTD2955T4G; V(BR)DSS Min (V): 60; Qrr Typ (nC): 100; Coss Typ (pF): 150; Crss Typ (pF): 50; PD Max (W): 55; ID Max (A): 12; Channel Polarity: P Channel; Configuration: Single; VGS Max (V): 20; VGS(th) Max (V): 4; Ciss Typ (pF): 500; ComponentLink1URL: http://www.onsemi.com/; DatasheetVersion: Rev. 13; Packing: Tape and Reel; PackageVersion: Rev. E, 02/2014; Mounting Technology: Surface Mount; ComponentLink3Description: Package Specification; Package Type: DPAK-3, IPAK-4; ComponentLink3URL: http://www.onsemi.cn/pub_link/Collateral/369C.PDF; RoHS: Pb-Free; ComponentLink2URL: http://www.onsemi.cn/pub_link/Collateral/NTD2955-D.PDF; ComponentLink2Description: Datasheet; PackageReference: DPAK-3-369C-01; PackageDescription: 3-Pin Flange Mount, Body 6.54 x 6.095 mm, Pitch 2.29 mm; ComponentLink1Description: Manufacturer URL
R31 = CMP-1012-00074-1: as R24 on sheet MCU; Technology: SMT; Tolerance: 5 %; Power: 0.1 W
R32 = CMP-1012-00122-1: 100K 0.1W 5% 0603 (1608 Metric)  SMD; Case-EIA: 0603; Value: 100000.00 Ohm; Case-Metric: 1608; Tolerance: 5 %; Power: 0.1 W; Technology: SMT
U14 = CMP-2000-06530-1: Precision Regulator, 0.5 A, 5 V Output, 0 to 150 degC, 3-Pin DPAK (TO252), RoHS, Tube; Manufacturer: STMicroelectronics; No. of Pins: 3Pins; SVHC: NoSVHC(17-Dec-2015); Input Voltage Max: 35V; Linear Regulator Case Style: TO-252; Output Voltage Nom.: 5V; Output Current: 500mA; Input Voltage Min: 10V; Manufacturer URL: http://www.st.com/; Operating Temperature Min: 0°C; Package Description: 3-Pin Transistor Outline, Body 6.5 x 6.1 mm, Pitch 2.28 mm; Package Reference: TO252; Datasheet Version: Rev. 20, 06/2014; Packaging: Each; Mounting Technology: SurfaceMount; Operating Temperature Max: 150°C; Datasheet URL: http://www.st.com/content/ccc/resource/technical/document/datasheet/d7/5f/dc/5c/d5/b6/48/7c/CD00000447.pdf/files/CD00000447.pdf/jcr:content/translations/en.CD00000447.pdf

## Nets that join several sheets
+5: MCU (P2.2 R23.2 U11.17 U11.38), IMD (U1.8 U2.5), LEM (6 pins), CAN (6 pins), TSAL (5 pins), Power (C17.2 D6.1 R31.2 U14.3)
+12: Offboard (J4.1), IMD (J1.2 Q1.3 R1.2 R2.2), LEM (J2.3 Q4.3 R9.2), Power (5 pins)
GND: Offboard (J4.12), MCU (16 pins), IMD (8 pins), LEM (14 pins), CAN (11 pins), TSAL (7 pins), Power (8 pins)
GND_ALT: Offboard (J4.11), IMD (J1.4)
HV: Offboard (J5.1 J5.3 J6.1 J6.3), TSAL (R13.2 R22.2)
HV_GND: Offboard (J5.2 J5.4 J6.2 J6.4), TSAL (12 pins)
CAN_CS: MCU (U11.43 Z1.4), CAN (U12.13)
CAN_INT: MCU (U11.40 Z1.5), CAN (U12.4)
CAN_INT0: MCU (U11.42), CAN (U12.9)
CAN_INT1: MCU (U11.41 Z1.6), CAN (U12.8)
CAN_N: Offboard (J4.10), CAN (D4.1 R28.1 TP23.1 U13.6)
CAN_P: Offboard (J4.3), CAN (D4.2 R26.2 TP20.1 U13.7)
CAN_RX: MCU (Z1.8), CAN (DS9.2 TP22.1 U12.2 U13.4)
CAN_TX: MCU (Z1.7), CAN (DS8.2 TP21.1 U12.1 U13.1)
IMD_MEASUREMENT: MCU (U11.14 U11.37), IMD (TP24.1 U1.1 U1.2)
IMD_STATUS: MCU (U11.13 U11.34), IMD (5 pins)
LEM_BUFFERED: MCU (U11.36), LEM (TP6.1 U3.1 U3.2 U4.3)
LEM_BUFFERED_REF: MCU (U11.35), LEM (TP7.1 U3.6 U3.7)
MCU_CLK: MCU (P2.3 U11.3 Z1.3), CAN (U12.10)
MCU_MISO: MCU (P2.1 U11.2 Z1.2), CAN (U12.12)
MCU_MOSI: MCU (P2.4 U11.1 Z1.1), CAN (U12.11)
NetJ4_2: Offboard (J4.2), LEM (R7.2)
NetJ4_4: Offboard (J4.4), IMD (Q1.2 TP3.1)
NetJ4_9: Offboard (J4.9), LEM (Q4.2 TP13.1)
NetR10_2: MCU (U11.32), LEM (R10.2 TP10.1 U4.1 U5.2)
TSAL_ACTIVE: MCU (U11.33), TSAL (R18.2 TP16.1 U6.4 U7.2)